# Altium project fast-open-switch r1.0.PrjPcb (part 1 of 8)
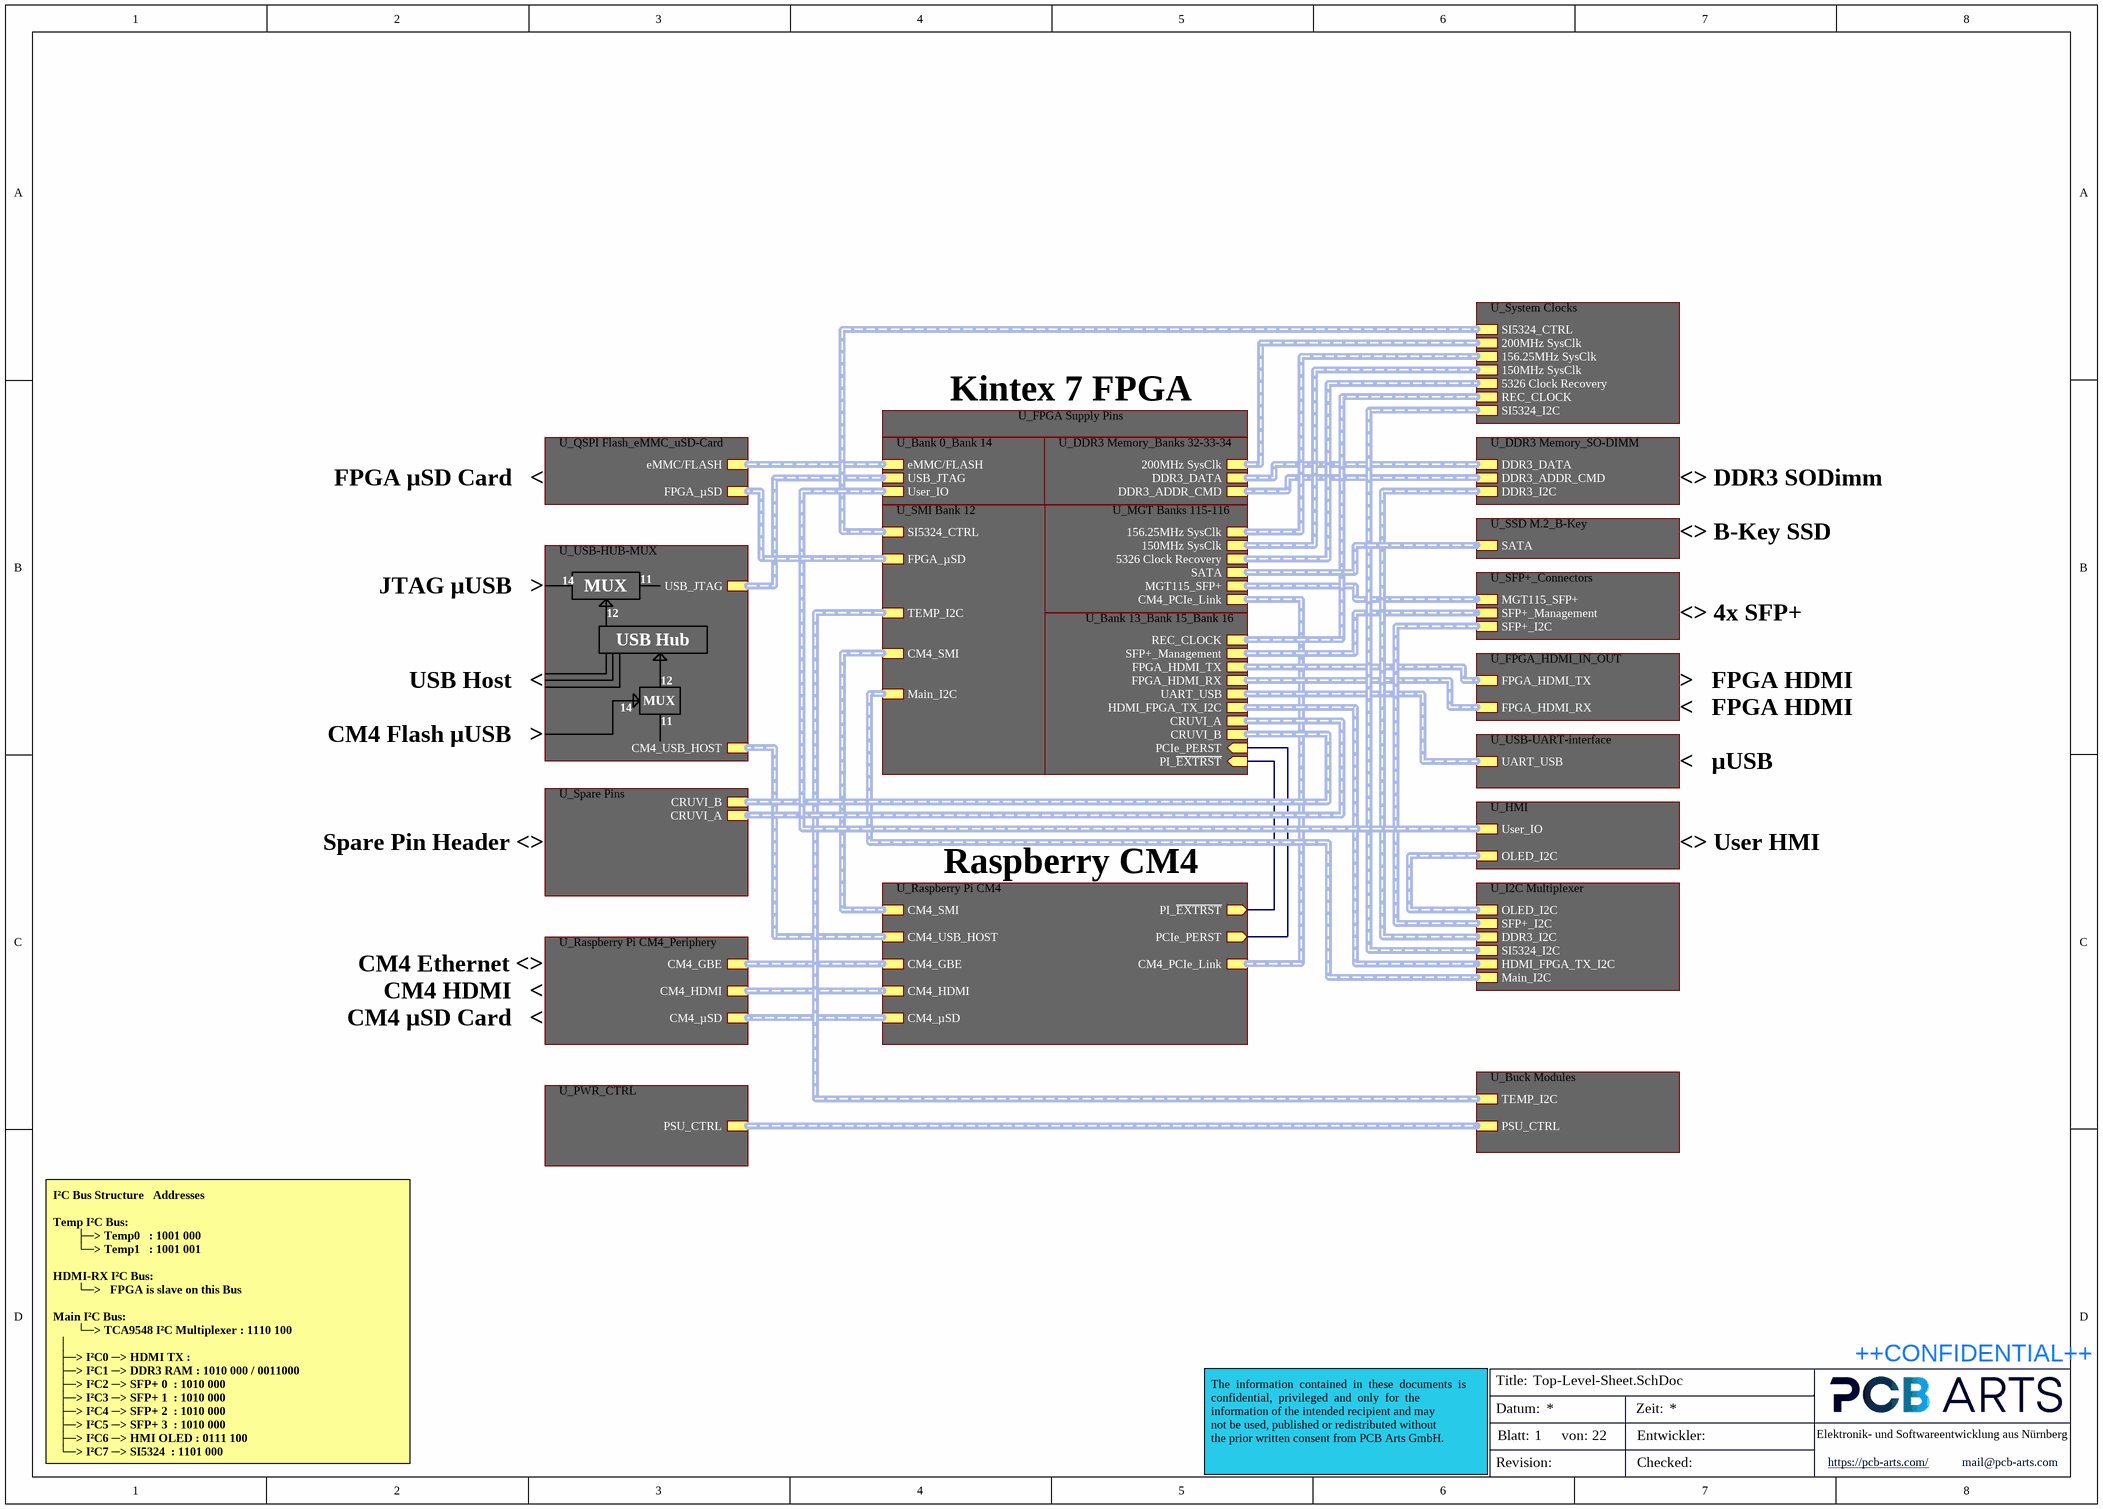
[diagram p0: Top-Level-Sheet.SchDoc]
22 sheets, 909 parts. Net scope: hierarchical (ports join the sheet entries above them; power ports are global).
Board file: fast-open-switch r1.0.PcbDoc
Sheets:
  Top-Level-Sheet.SchDoc
    U_Bank 0_Bank 14 = Bank 0_Bank 14.SchDoc
    U_Bank 13_Bank 15_Bank 16 = Bank 13_Bank 15_Bank 16.SchDoc
    U_DDR3 Memory_Banks 32-33-34 = DDR3 Memory_Banks 32-33-34.SchDoc
    U_DDR3 Memory_SO-DIMM = DDR3 Memory_SO-DIMM.SchDoc
    U_FPGA_HDMI_IN_OUT = FPGA_HDMI_IN_OUT.SchDoc
    U_HMI = HMI.SchDoc
    U_MGT Banks 115-116 = MGT Banks 115-116.SchDoc
    U_QSPI Flash_eMMC_uSD-Card = QSPI Flash_eMMC_uSD-Card.SchDoc
    U_Raspberry Pi CM4 = Raspberry Pi CM4.SchDoc
    U_SFP+_Connectors = SFP+_Connectors.SchDoc
    U_SMI Bank 12 = SMI Bank 12.SchDoc
    U_SSD M.2_B-Key = SSD M.2_B-Key.SchDoc
    U_USB-HUB-MUX = USB-HUB-MUX.SchDoc
    U_USB-UART-interface = USB-UART-interface.SchDoc
    U_Raspberry Pi CM4_Periphery = Raspberry Pi CM4_Periphery.SchDoc
    U_I2C Multiplexer = I2C Multiplexer.SchDoc
    U_System Clocks = System Clocks.SchDoc
    U_FPGA Supply Pins = FPGA Supply Pins.SchDoc
    U_PWR_CTRL = PWR_CTRL.SchDoc
    U_Buck Modules = Buck Modules.SchDoc
    U_Spare Pins = Spare Pins.SchDoc

## Sheet Top-Level-Sheet.SchDoc
size A3; SheetNumber: 1; SheetTotal: 22

### Sub-sheets
U_Bank 0_Bank 14 = Bank 0_Bank 14.SchDoc: eMMC/FLASH (harness eMMC/FLASH), USB_JTAG (harness USB_JTAG), User_IO (harness User_IO)
U_Bank 13_Bank 15_Bank 16 = Bank 13_Bank 15_Bank 16.SchDoc: UART_USB (harness UART_USB), FPGA_HDMI_TX (harness FPGA_HDMI_TX), FPGA_HDMI_RX (harness FPGA_HDMI_RX), HDMI_FPGA_TX_I2C (harness HDMI_FPGA_TX_I2C), SFP+_Management (harness SFP+_Management), REC_CLOCK (harness REC_CLOCK), PCIe_PERST (in), PI_~{EXTRST} (in), CRUVI_A (harness CRUVI_A), CRUVI_B (harness CRUVI_B)
U_Buck Modules = Buck Modules.SchDoc: PSU_CTRL (harness PSU_CTRL), TEMP_I2C (harness TEMP_I2C)
U_DDR3 Memory_Banks 32-33-34 = DDR3 Memory_Banks 32-33-34.SchDoc: DDR3_DATA (harness DDR3_DATA), DDR3_ADDR_CMD (harness DDR3_ADDR_CMD), 200MHz SysClk (harness 200MHz SysClk)
U_DDR3 Memory_SO-DIMM = DDR3 Memory_SO-DIMM.SchDoc: DDR3_DATA (harness DDR3_DATA), DDR3_ADDR_CMD (harness DDR3_ADDR_CMD), DDR3_I2C (harness DDR3_I2C)
U_FPGA Supply Pins = FPGA Supply Pins.SchDoc: no entries
U_FPGA_HDMI_IN_OUT = FPGA_HDMI_IN_OUT.SchDoc: FPGA_HDMI_TX (harness FPGA_HDMI_TX), FPGA_HDMI_RX (harness FPGA_HDMI_RX)
U_HMI = HMI.SchDoc: User_IO (harness User_IO), OLED_I2C (harness OLED_I2C)
U_I2C Multiplexer = I2C Multiplexer.SchDoc: HDMI_FPGA_TX_I2C (harness HDMI_FPGA_TX_I2C), DDR3_I2C (harness DDR3_I2C), SFP+_I2C (harness SFP+_I2C), OLED_I2C (harness OLED_I2C), Main_I2C (harness Main_I2C), SI5324_I2C (harness SI5324_I2C)
U_MGT Banks 115-116 = MGT Banks 115-116.SchDoc: MGT115_SFP+ (harness MGT115_SFP+), CM4_PCIe_Link (harness CM4_PCIe_Link), SATA (harness SATA), 150MHz SysClk (harness 150MHz SysClk), 5326 Clock Recovery (harness 5326 Clock Recovery), 156.25MHz SysClk (harness 156.25MHz SysClk)
U_PWR_CTRL = PWR_CTRL.SchDoc: PSU_CTRL (harness PSU_CTRL)
U_QSPI Flash_eMMC_uSD-Card = QSPI Flash_eMMC_uSD-Card.SchDoc: FPGA_µSD (harness FPGA_µSD), eMMC/FLASH (harness eMMC/FLASH)
U_Raspberry Pi CM4 = Raspberry Pi CM4.SchDoc: CM4_GBE (harness CM4_GBE), CM4_HDMI (harness CM4_HDMI), CM4_PCIe_Link (harness CM4_PCIe_Link), CM4_USB_HOST (harness CM4_USB_HOST), CM4_µSD (harness CM4_µSD), CM4_SMI (harness CM4_SMI), PCIe_PERST (out), PI_~{EXTRST} (out)
U_Raspberry Pi CM4_Periphery = Raspberry Pi CM4_Periphery.SchDoc: CM4_GBE (harness CM4_GBE), CM4_HDMI (harness CM4_HDMI), CM4_µSD (harness CM4_µSD)
U_SFP+_Connectors = SFP+_Connectors.SchDoc: MGT115_SFP+ (harness MGT115_SFP+), SFP+_Management (harness SFP+_Management), SFP+_I2C (harness SFP+_I2C)
U_SMI Bank 12 = SMI Bank 12.SchDoc: CM4_SMI (harness CM4_SMI), FPGA_µSD (harness FPGA_µSD), Main_I2C (harness Main_I2C), SI5324_CTRL (harness SI5324_CTRL), TEMP_I2C (harness TEMP_I2C)
U_Spare Pins = Spare Pins.SchDoc: CRUVI_A (harness CRUVI_A), CRUVI_B (harness CRUVI_B)
U_SSD M.2_B-Key = SSD M.2_B-Key.SchDoc: SATA (harness SATA)
U_System Clocks = System Clocks.SchDoc: 150MHz SysClk (harness 150MHz SysClk), 5326 Clock Recovery (harness 5326 Clock Recovery), 200MHz SysClk (harness 200MHz SysClk), REC_CLOCK (harness REC_CLOCK), SI5324_I2C (harness SI5324_I2C), SI5324_CTRL (harness SI5324_CTRL), 156.25MHz SysClk (harness 156.25MHz SysClk)
U_USB-HUB-MUX = USB-HUB-MUX.SchDoc: CM4_USB_HOST (harness CM4_USB_HOST), USB_JTAG (harness USB_JTAG)
U_USB-UART-interface = USB-UART-interface.SchDoc: UART_USB (harness UART_USB)

### Nets
PCIe_PERST: sheet U_Bank 13_Bank 15_Bank 16/PCIe_PERST, sheet U_Raspberry Pi CM4/PCIe_PERST
PI_~{EXTRST}: sheet U_Bank 13_Bank 15_Bank 16/PI_~{EXTRST}, sheet U_Raspberry Pi CM4/PI_~{EXTRST}

### Buses and harness runs
harness sheet U_Bank 0_Bank 14/eMMC/FLASH = sheet U_QSPI Flash_eMMC_uSD-Card/eMMC/FLASH
harness sheet U_Bank 0_Bank 14/USB_JTAG = sheet U_USB-HUB-MUX/USB_JTAG
harness sheet U_Bank 0_Bank 14/User_IO = sheet U_HMI/User_IO
harness sheet U_Bank 13_Bank 15_Bank 16/CRUVI_A = sheet U_Spare Pins/CRUVI_A
harness sheet U_Bank 13_Bank 15_Bank 16/CRUVI_B = sheet U_Spare Pins/CRUVI_B
harness sheet U_Bank 13_Bank 15_Bank 16/FPGA_HDMI_RX = sheet U_FPGA_HDMI_IN_OUT/FPGA_HDMI_RX
harness sheet U_Bank 13_Bank 15_Bank 16/FPGA_HDMI_TX = sheet U_FPGA_HDMI_IN_OUT/FPGA_HDMI_TX
harness sheet U_Bank 13_Bank 15_Bank 16/HDMI_FPGA_TX_I2C = sheet U_I2C Multiplexer/HDMI_FPGA_TX_I2C
harness sheet U_Bank 13_Bank 15_Bank 16/REC_CLOCK = sheet U_System Clocks/REC_CLOCK
harness sheet U_Bank 13_Bank 15_Bank 16/SFP+_Management = sheet U_SFP+_Connectors/SFP+_Management
harness sheet U_Bank 13_Bank 15_Bank 16/UART_USB = sheet U_USB-UART-interface/UART_USB
harness sheet U_Buck Modules/PSU_CTRL = sheet U_PWR_CTRL/PSU_CTRL
harness sheet U_Buck Modules/TEMP_I2C = sheet U_SMI Bank 12/TEMP_I2C
harness sheet U_DDR3 Memory_Banks 32-33-34/200MHz SysClk = sheet U_System Clocks/200MHz SysClk
harness sheet U_DDR3 Memory_Banks 32-33-34/DDR3_ADDR_CMD = sheet U_DDR3 Memory_SO-DIMM/DDR3_ADDR_CMD
harness sheet U_DDR3 Memory_Banks 32-33-34/DDR3_DATA = sheet U_DDR3 Memory_SO-DIMM/DDR3_DATA
harness sheet U_DDR3 Memory_SO-DIMM/DDR3_I2C = sheet U_I2C Multiplexer/DDR3_I2C
harness sheet U_HMI/OLED_I2C = sheet U_I2C Multiplexer/OLED_I2C
harness sheet U_I2C Multiplexer/Main_I2C = sheet U_SMI Bank 12/Main_I2C
harness sheet U_I2C Multiplexer/SFP+_I2C = sheet U_SFP+_Connectors/SFP+_I2C
harness sheet U_I2C Multiplexer/SI5324_I2C = sheet U_System Clocks/SI5324_I2C
harness sheet U_MGT Banks 115-116/150MHz SysClk = sheet U_System Clocks/150MHz SysClk
harness sheet U_MGT Banks 115-116/156.25MHz SysClk = sheet U_System Clocks/156.25MHz SysClk
harness sheet U_MGT Banks 115-116/5326 Clock Recovery = sheet U_System Clocks/5326 Clock Recovery
harness sheet U_MGT Banks 115-116/CM4_PCIe_Link = sheet U_Raspberry Pi CM4/CM4_PCIe_Link
harness sheet U_MGT Banks 115-116/MGT115_SFP+ = sheet U_SFP+_Connectors/MGT115_SFP+
harness sheet U_MGT Banks 115-116/SATA = sheet U_SSD M.2_B-Key/SATA
harness sheet U_QSPI Flash_eMMC_uSD-Card/FPGA_µSD = sheet U_SMI Bank 12/FPGA_µSD
harness sheet U_Raspberry Pi CM4/CM4_GBE = sheet U_Raspberry Pi CM4_Periphery/CM4_GBE
harness sheet U_Raspberry Pi CM4/CM4_HDMI = sheet U_Raspberry Pi CM4_Periphery/CM4_HDMI
harness sheet U_Raspberry Pi CM4/CM4_SMI = sheet U_SMI Bank 12/CM4_SMI
harness sheet U_Raspberry Pi CM4/CM4_USB_HOST = sheet U_USB-HUB-MUX/CM4_USB_HOST
harness sheet U_Raspberry Pi CM4/CM4_µSD = sheet U_Raspberry Pi CM4_Periphery/CM4_µSD
harness sheet U_SMI Bank 12/SI5324_CTRL = sheet U_System Clocks/SI5324_CTRL

### Notes on the sheet
- Kintex 7 FPGA
- FPGA µSD Card   <
- <> DDR3 SODimm
- JTAG µUSB   >
- 14
- MUX
- 11
- <> B-Key SSD
- 12
- USB Hub
- <> 4x SFP+
- USB Host   <
- >   FPGA HDMI
- <   FPGA HDMI
- CM4 Flash µUSB   >
- <   µUSB
- Spare Pin Header <>
- <> User HMI
- Raspberry CM4
- CM4 HDMI   <
- CM4 Ethernet <>
- CM4 µSD Card   <
- I²C Bus Structure			Addresses
  Temp I²C Bus:
  ├─>	Temp0			: 1001 000
  └─>	Temp1			: 1001 001
  HDMI-RX I²C Bus:
  └─>			FPGA is slave on this Bus
  Main I²C Bus:
  └─>	TCA9548 I²C Multiplexer	: 1110 100
  │
  ├─> I²C0 ─> HDMI TX	:
  ├─> I²C1 ─> DDR3 RAM	: 1010 000 / 0011000
  ├─> I²C2 ─> SFP+ 0		: 1010 000
  ├─> I²C3 ─> SFP+ 1		: 1010 000
  ├─> I²C4 ─> SFP+ 2		: 1010 000
  ├─> I²C5 ─> SFP+ 3		: 1010 000
  ├─> I²C6 ─> HMI OLED	: 0111 100
  └─> I²C7 ─> SI5324		: 1101 000
- Title:
- ++CONFIDENTIAL++
- Datum:
- Blatt:
- von:
- Zeit:
- Entwickler:
- Elektronik- und Softwareentwicklung aus Nürnberg
- The  information  contained  in  these  documents  is  confidential,  privileged  and  only  for  the
  information of the intended recipient and may
  not be used, published or redistributed without
  the prior written consent from PCB Arts GmbH.
- Revision:
- Checked:
- https://pcb-arts.com/
- mail@pcb-arts.com

## Sheet Bank 0_Bank 14.SchDoc
size A3; SheetNumber: 12; SheetTotal: 22
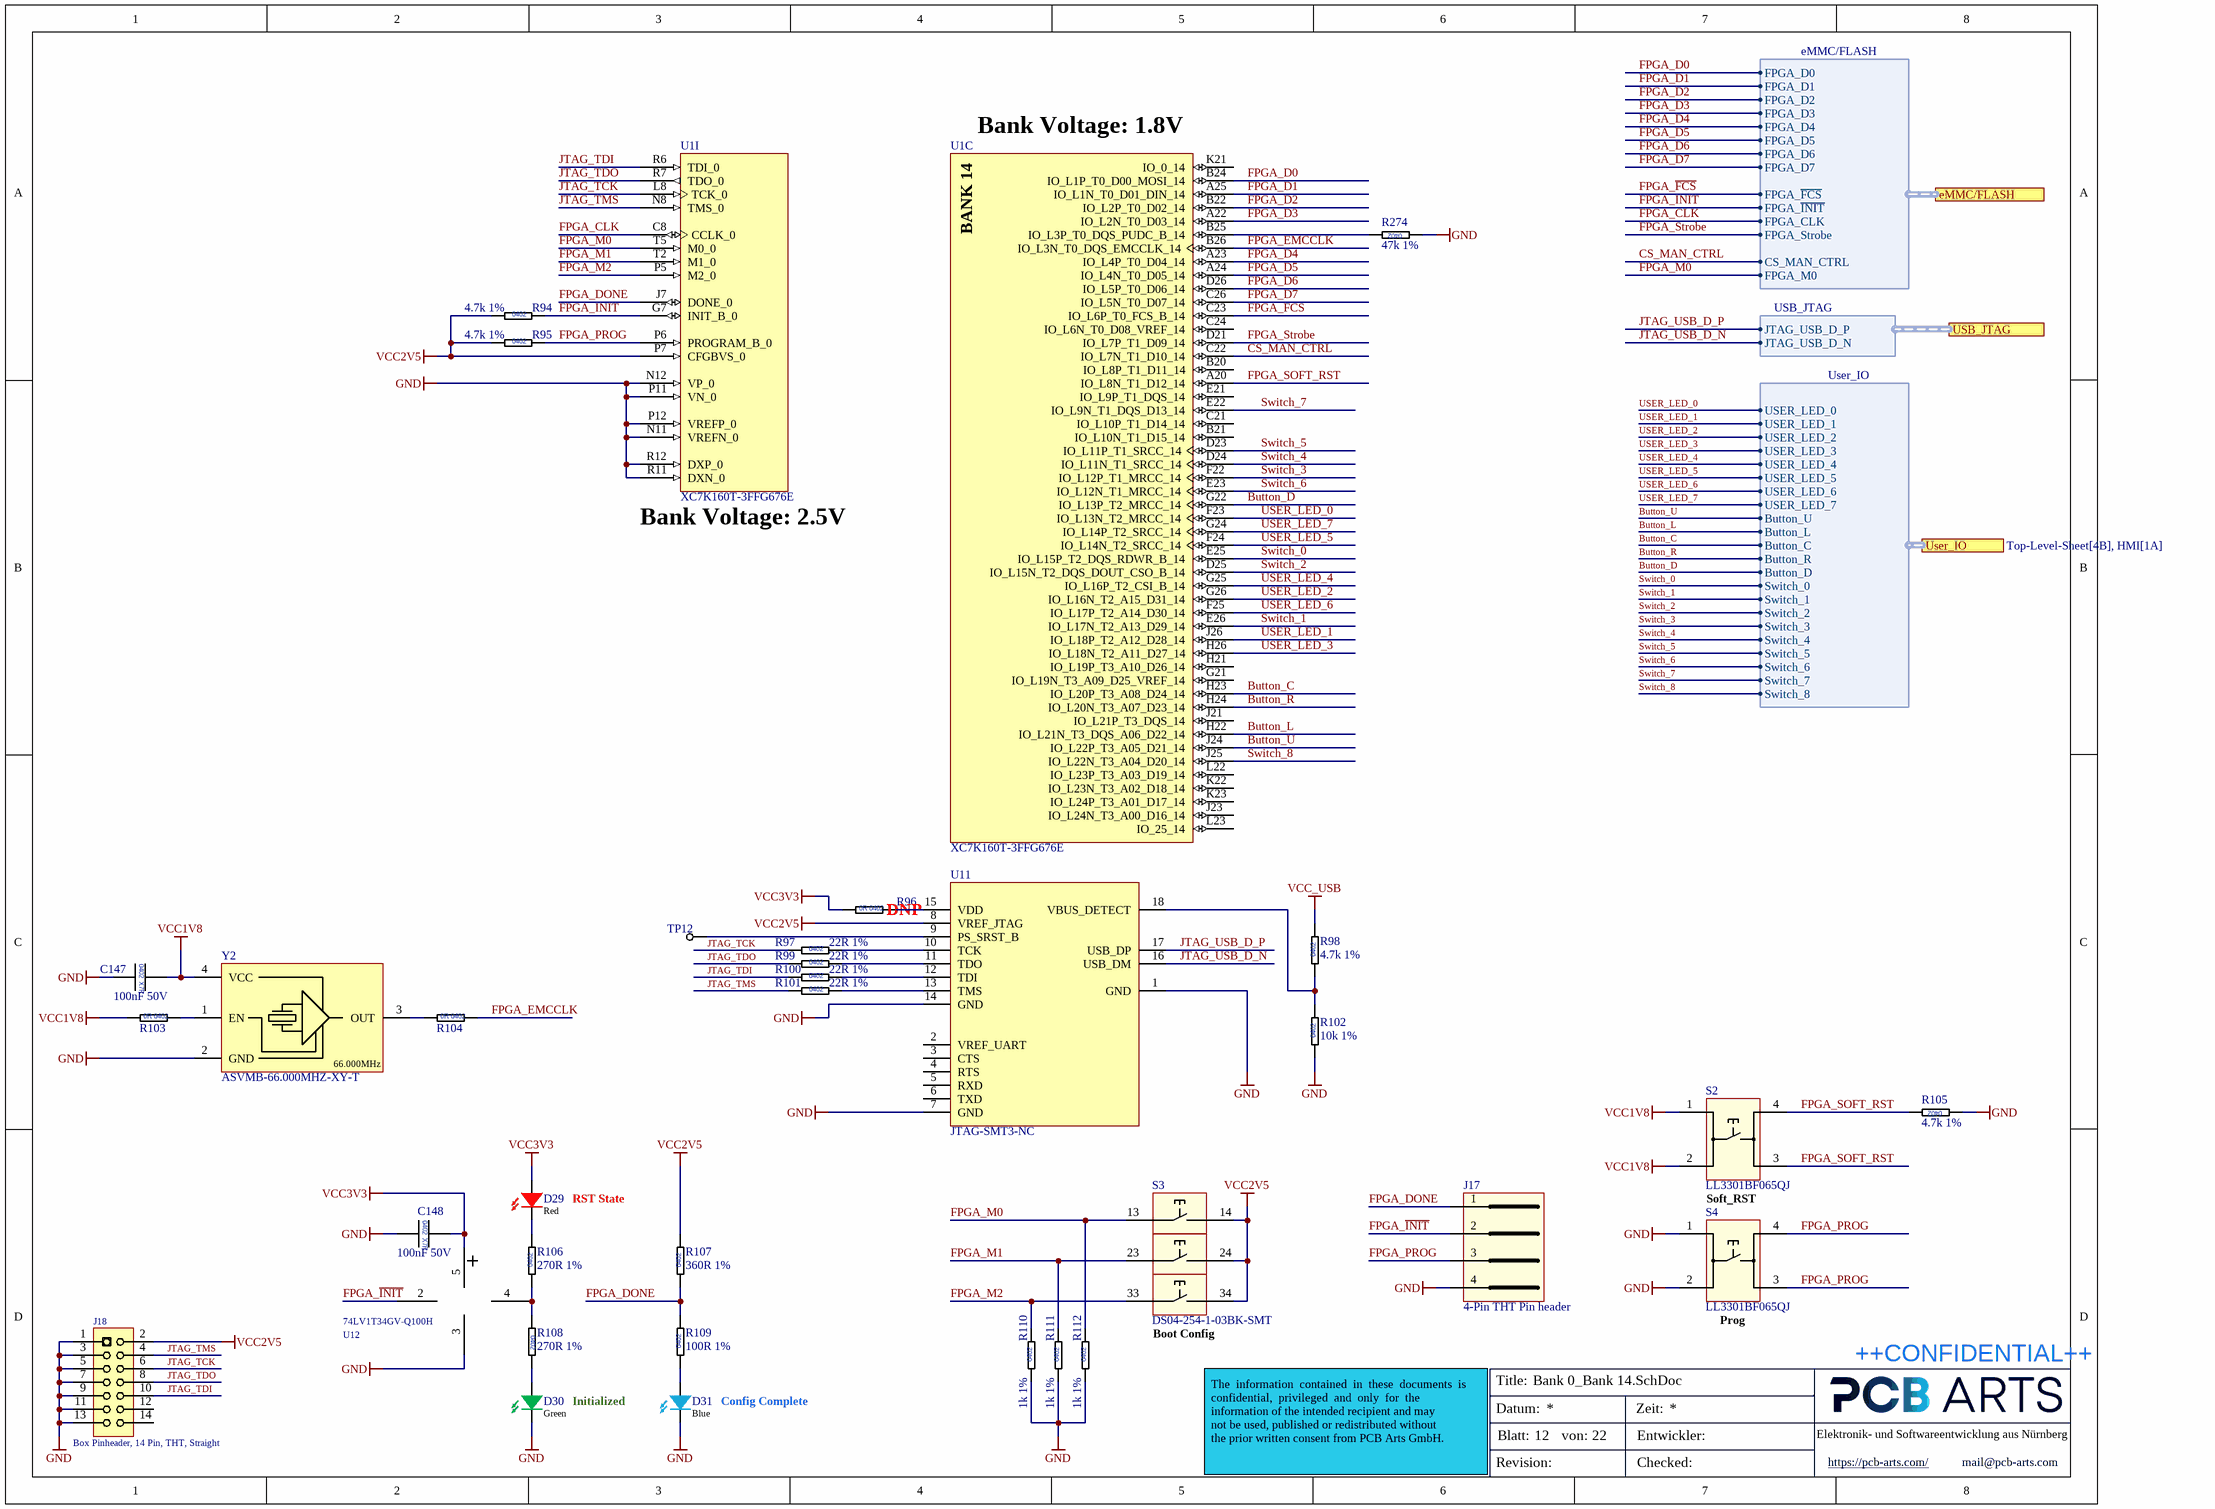
[diagram p1: Bank 0_Bank 14.SchDoc]

### Parts
C147  100nF 50V  [CAP_0402_L]
C148  100nF 50V  [CAP_0402_L]
D29  Color: Red  [LED-0603 Sideview]  (hidden comment: LTST-S270KRKT)
D30  Color: Green  [LED-0603 Sideview]  (hidden comment: LTST-S270KGKT)
D31  Color: Blue  [LED-0603 Sideview]  (hidden comment: LTST-S270TBKT)
J17  4-Pin THT Pin header  [61300411121]
J18  Box Pinheader, 14 Pin, THT, Straight  [87832-1420]
R94  4.7k 1%  [RES_0402_L]
R95  4.7k 1%  [RES_0402_L]
R96  0R Jumper  [RES_0402_L]  (value not drawn)  (no BOM)
R97  22R 1%  [RES_0402_L]
R98  4.7k 1%  [RES_0402_L]
R99  22R 1%  [RES_0402_L]
R100  22R 1%  [RES_0402_L]
R101  22R 1%  [RES_0402_L]
R102  10k 1%  [RES_0402_L]
R103  0R Jumper  [RES_0402_L]  (value not drawn)
R104  0R Jumper  [RES_0402_L]  (value not drawn)
R105  4.7k 1%  [RES_0402_L]
R106  270R 1%  [RES_0402_L]
R107  360R 1%  [RES_0402_L]
R108  270R 1%  [RES_0402_L]
R109  100R 1%  [RES_0402_L]
R110  1k 1%  [RES_0402_L]
R111  1k 1%  [RES_0402_L]
R112  1k 1%  [RES_0402_L]
R274  47k 1%  [RES_0402_L]
S2  LL3301BF065QJ  [LL3301BF065QJ]
S3  DS04-254-1-03BK-SMT  [CUI DS04-254-SMT Series, 3 Pole]
S4  LL3301BF065QJ  [LL3301BF065QJ]
TP12  Testpoint  [Testpoint 0.8mm]  (value not drawn)  (no BOM)
U1  XC7K160T-3FFG676E  [BGA100P2700X2700X317-676N]  (parts C,I of 14)
U11  JTAG-SMT3-NC  [JTAG-SMT3-NC]
U12  74LV1T34GV-Q100H  [SOT95P275X110-5N]
Y2  ASVMB-66.000MHZ-XY-T  [ASVMB Series]

### Ports
eMMC/FLASH (harness eMMC/FLASH, see Top-Level-Sheet[4B], QSPI Flash_eMMC_uSD-Card[1A]), USB_JTAG (harness USB_JTAG, see Top-Level-Sheet[4B], USB-HUB-MUX[8C]), User_IO (harness User_IO, see Top-Level-Sheet[4B], HMI[1A])

### Harnesses
eMMC/FLASH: FPGA_D0, FPGA_D1, FPGA_D2, FPGA_D3, FPGA_D4, FPGA_D5, FPGA_D6, FPGA_D7, FPGA_~{FCS}, FPGA_~{INIT}, FPGA_CLK, FPGA_Strobe, FPGA_M0, CS_MAN_CTRL
USB_JTAG: JTAG_USB_D_P, JTAG_USB_D_N
User_IO: USER_LED_0, USER_LED_1, USER_LED_2, USER_LED_3, USER_LED_4, USER_LED_5, USER_LED_6, USER_LED_7, Switch_0, Switch_1, Switch_2, Switch_3, Switch_4, Switch_5, Button_L, Button_U, Button_C, Button_R, Button_D, Switch_6, Switch_7, Switch_8

### Nets
GND: C147.2 C148.2 D30.1 D31.1 J17.4 J18.1 J18.3 J18.5 J18.7 J18.9 J18.11 J18.13 R102.1 R105.1 R110.1 R111.1 R112.1 R274.1 S4.1 S4.2 U1.N11(VREFN_0) U1.N12(VP_0) U1.P11(VN_0) U1.P12(VREFP_0) U1.R11(DXN_0) U1.R12(DXP_0) U11.1(GND) U11.7(GND) U11.14(GND) U12.3(GND) Y2.2(GND)
VCC1V8: C147.1 R103.1 S2.1 S2.2 Y2.4(VCC)
VCC2V5: J18.2 R94.1 R95.1 R107.2 S3.14 S3.24 S3.34 U1.P7(CFGBVS_0) U11.8(VREF_JTAG)
VCC3V3: C148.1 D29.2 R96.1 U12.5(VCC)
VCC_USB: R98.2
Button_C: U1.H23(IO_L20P_T3_A08_D24_14) ; port User_IO.Button_C
Button_D: U1.G22(IO_L13P_T2_MRCC_14) ; port User_IO.Button_D
Button_L: U1.H22(IO_L21N_T3_DQS_A06_D22_14) ; port User_IO.Button_L
Button_R: U1.H24(IO_L20N_T3_A07_D23_14) ; port User_IO.Button_R
Button_U: U1.J24(IO_L22P_T3_A05_D21_14) ; port User_IO.Button_U
CS_MAN_CTRL: U1.C22(IO_L7N_T1_D10_14) ; port eMMC/FLASH.CS_MAN_CTRL
FPGA_CLK: U1.C8(CCLK_0) ; port eMMC/FLASH.FPGA_CLK
FPGA_D0: U1.B24(IO_L1P_T0_D00_MOSI_14) ; port eMMC/FLASH.FPGA_D0
FPGA_D1: U1.A25(IO_L1N_T0_D01_DIN_14) ; port eMMC/FLASH.FPGA_D1
FPGA_D2: U1.B22(IO_L2P_T0_D02_14) ; port eMMC/FLASH.FPGA_D2
FPGA_D3: U1.A22(IO_L2N_T0_D03_14) ; port eMMC/FLASH.FPGA_D3
FPGA_D4: U1.A23(IO_L4P_T0_D04_14) ; port eMMC/FLASH.FPGA_D4
FPGA_D5: U1.A24(IO_L4N_T0_D05_14) ; port eMMC/FLASH.FPGA_D5
FPGA_D6: U1.D26(IO_L5P_T0_D06_14) ; port eMMC/FLASH.FPGA_D6
FPGA_D7: U1.C26(IO_L5N_T0_D07_14) ; port eMMC/FLASH.FPGA_D7
FPGA_DONE: J17.1 R107.1 R109.2 U1.J7(DONE_0)
FPGA_EMCCLK: R104.2 U1.B26(IO_L3N_T0_DQS_EMCCLK_14)
FPGA_~{FCS}: U1.C23(IO_L6P_T0_FCS_B_14) ; port eMMC/FLASH.FPGA_~{FCS}
FPGA_~{INIT}: J17.2 R94.2 U1.G7(INIT_B_0) U12.2(A) ; port eMMC/FLASH.FPGA_~{INIT}
FPGA_M0: R112.2 S3.13 U1.T5(M0_0) ; port eMMC/FLASH.FPGA_M0
FPGA_M1: R111.2 S3.23 U1.T2(M1_0)
FPGA_M2: R110.2 S3.33 U1.P5(M2_0)
FPGA_PROG: J17.3 R95.2 S4.3 S4.4 U1.P6(PROGRAM_B_0)
FPGA_SOFT_RST: R105.2 S2.3 S2.4 U1.A20(IO_L8N_T1_D12_14)
FPGA_Strobe: U1.D21(IO_L7P_T1_D09_14) ; port eMMC/FLASH.FPGA_Strobe
JTAG_TCK: J18.6 R97.1 U1.L8(TCK_0)
JTAG_TDI: J18.10 R100.1 U1.R6(TDI_0)
JTAG_TDO: J18.8 R99.1 U1.R7(TDO_0)
JTAG_TMS: J18.4 R101.1 U1.N8(TMS_0)
JTAG_USB_D_N: U11.16(USB_DM) ; port USB_JTAG.JTAG_USB_D_N
JTAG_USB_D_P: U11.17(USB_DP) ; port USB_JTAG.JTAG_USB_D_P
Switch_0: U1.E25(IO_L15P_T2_DQS_RDWR_B_14) ; port User_IO.Switch_0
Switch_1: U1.E26(IO_L17N_T2_A13_D29_14) ; port User_IO.Switch_1
Switch_2: U1.D25(IO_L15N_T2_DQS_DOUT_CSO_B_14) ; port User_IO.Switch_2
Switch_3: U1.F22(IO_L12P_T1_MRCC_14) ; port User_IO.Switch_3
Switch_4: U1.D24(IO_L11N_T1_SRCC_14) ; port User_IO.Switch_4
Switch_5: U1.D23(IO_L11P_T1_SRCC_14) ; port User_IO.Switch_5
Switch_6: U1.E23(IO_L12N_T1_MRCC_14) ; port User_IO.Switch_6
Switch_7: U1.E22(IO_L9N_T1_DQS_D13_14) ; port User_IO.Switch_7
Switch_8: U1.J25(IO_L22N_T3_A04_D20_14) ; port User_IO.Switch_8
USER_LED_0: U1.F23(IO_L13N_T2_MRCC_14) ; port User_IO.USER_LED_0
USER_LED_1: U1.J26(IO_L18P_T2_A12_D28_14) ; port User_IO.USER_LED_1
USER_LED_2: U1.G26(IO_L16N_T2_A15_D31_14) ; port User_IO.USER_LED_2
USER_LED_3: U1.H26(IO_L18N_T2_A11_D27_14) ; port User_IO.USER_LED_3
USER_LED_4: U1.G25(IO_L16P_T2_CSI_B_14) ; port User_IO.USER_LED_4
USER_LED_5: U1.F24(IO_L14N_T2_SRCC_14) ; port User_IO.USER_LED_5
USER_LED_6: U1.F25(IO_L17P_T2_A14_D30_14) ; port User_IO.USER_LED_6
USER_LED_7: U1.G24(IO_L14P_T2_SRCC_14) ; port User_IO.USER_LED_7
NetD29_1: D29.1 R106.2
NetD30_2: D30.2 R108.2
NetD31_2: D31.2 R109.1
NetR96_2: R96.2 U11.15(VDD)
NetR97_2: R97.2 U11.10(TCK)
NetR98_1: R98.1 R102.2 U11.18(VBUS_DETECT)
NetR99_2: R99.2 U11.11(TDO)
NetR100_2: R100.2 U11.12(TDI)
NetR101_2: R101.2 U11.13(TMS)
NetR103_2: R103.2 Y2.1(EN)
NetR104_1: R104.1 Y2.3(OUT)
NetR106_1: R106.1 R108.1 U12.4(Y)
NetR274_2: R274.2 U1.B25(IO_L3P_T0_DQS_PUDC_B_14)
NetTP12_1: TP12.1(GND) U11.9(PS_SRST_B)

Not connected (* = marked no-connect by the designer): J18 12 14; U1 B20(IO_L8P_T1_D11_14) B21(IO_L10N_T1_D15_14) C21(IO_L10P_T1_D14_14) C24(IO_L6N_T0_D08_VREF_14) E21(IO_L9P_T1_DQS_14) G21(IO_L19N_T3_A09_D25_VREF_14) H21(IO_L19P_T3_A10_D26_14) J21(IO_L21P_T3_DQS_14) J23(IO_L24N_T3_A00_D16_14) K21(IO_0_14) K22(IO_L23N_T3_A02_D18_14) K23(IO_L24P_T3_A01_D17_14) L22(IO_L23P_T3_A03_D19_14) L23(IO_25_14); U11 2(VREF_UART) 3(CTS) 4(RTS) 5(RXD) 6(TXD)

### Notes on the sheet
- (near U1) Bank Voltage: 1.8V
- (near U1) Bank Voltage: 2.5V
- (near R96) DNP
- RST State
- Soft_RST
- (near S4) Prog
- (near S3) Boot Config
- Initialized
- Config Complete
- Title:
- ++CONFIDENTIAL++
- Datum:
- Blatt:
- von:
- Zeit:
- Entwickler:
- Elektronik- und Softwareentwicklung aus Nürnberg
- The  information  contained  in  these  documents  is  confidential,  privileged  and  only  for  the
  information of the intended recipient and may
  not be used, published or redistributed without
  the prior written consent from PCB Arts GmbH.
- Revision:
- Checked:
- https://pcb-arts.com/
- mail@pcb-arts.com
- (in symbol ASVMB-66.000MHZ-XY-T_Clock-Memsoszillator 66.000MHz 1.8V 10ppm -40C +105C) 66.000MHz
- (in symbol CAP_0402_100nF_50V) 0402; X7R
- (in symbol RES_0402_0R Jumper) 0R 0402
- (in symbol RES_0402_1k_1%) 0402
- (in symbol RES_0402_4.7k_1%) 0402
- (in symbol RES_0402_10k_1%) 0402
- (in symbol RES_0402_22R_1%) 0402
- (in symbol RES_0402_47k_1%) 0402
- (in symbol RES_0402_100R_1%) 0402
- (in symbol RES_0402_270R 1%) 0402
- (in symbol RES_0402_360R_1%) 0402
- (in symbol XC7K160T-3FFG676E_Kintex-7 FPGA, 400 User I/Os, 8 GTX, FFG676, part C) BANK 14

### Library data of the parts
C147 C148 = CAP_0402_100nF_50V: Multilayer Ceramic Capacitors MLCC - SMD/SMT 0402 50VDC; Manufacturer 1: Murata Electronics; Manufacturer 1 Prt. Nr.: GCM155L8EH104KE07D; Manufacturer 2 Prt. Nr.: UMK105B7104KV-FR; Manufacturer 2: TDK
D29 = LED 0603 Red Sideview: RED  0603 Light Emitting Diode; Manufacturer 1: lite-On; Manufacturer 1 Prt. Nr.: LTST-S270KRKT
D30 = LED 0603 Green Sideview: GREEN  0603 Light Emitting Diode; Manufacturer 1: lite-On; Manufacturer 1 Prt. Nr.: LTST-S270KGKT
D31 = LED 0603 Blue Sideview: BLUE  0603 Light Emitting Diode; Manufacturer 1: lite-On; Manufacturer 1 Prt. Nr.: LTST-S270TBKT
J17 = 61300411121_WR-PHD 2.54mm 4Pin THT Header: WR-PHD 2.54mm 4Pin THT Header; Manufacturer 1: Würth Elektronik; Manufacturer 1 Prt. Nr.: 61300411121
J18 = 87832-1420_Box Pin header THT 2.00mm Box 14Pol Straight: Box Pin header THT 2.00mm 14Pol Straight; Manufacturer 1: Molex; Manufacturer 1 Prt. Nr.: 87832-1420
R94 R95 R98 R105 = RES_0402_4.7k_1%: Thick Film Resistors - SMD 4.7kOhm 1%; Manufacturer 1: Vishay / Dale; Manufacturer 1 Prt. Nr.: CRCW04024K70FKEDC; Manufacturer 2 Prt. Nr.: RC0402FR-134K7L; Manufacturer 2: Yageo
R96 R103 R104 = RES_0402_0R Jumper: Thick Film Resistors - SMD 0Ohm; Manufacturer 1: Vishay / Dale; Manufacturer 1 Prt. Nr.: CRCW04020000Z0EDC; Manufacturer 2 Prt. Nr.: RC0402JR-070RL; Manufacturer 2: Yageo
R97 R99-R101 = RES_0402_22R_1%: Thick Film Resistors - SMD 22Ohm 1%; Manufacturer 1: Vishay / Dale; Manufacturer 1 Prt. Nr.: CRCW040222R0FKEDC; Manufacturer 2 Prt. Nr.: RC0402FR-7W22RL; Manufacturer 2: Yageo
R102 = RES_0402_10k_1%: Thick Film Resistors - SMD 10kOhm 1%; Manufacturer 1: Vishay / Dale; Manufacturer 1 Prt. Nr.: CRCW040210K0FKEDC; Manufacturer 2 Prt. Nr.: RC0402FR-7W10KL; Manufacturer 2: Yageo
R106 R108 = RES_0402_270R 1%: Thick Film Resistors - SMD 270Ohm 1%; Manufacturer 1: Vishay / Dale; Manufacturer 1 Prt. Nr.: CRCW0402270RFKEDC; Manufacturer 2 Prt. Nr.: RC0402FR-07270RL; Manufacturer 2: Yageo
R107 = RES_0402_360R_1%: Thick Film Resistors - SMD 360Ohm 1%; Manufacturer 1: Vishay / Dale; Manufacturer 1 Prt. Nr.: CRCW0402360RFKED; Manufacturer 2 Prt. Nr.: AC0402FR-07360RL; Manufacturer 2: Yageo
R109 = RES_0402_100R_1%: Thick Film Resistors - SMD 100Ohm 1%; Manufacturer 1: Vishay / Dale; Manufacturer 1 Prt. Nr.: CRCW0402100RFKEE; Manufacturer 2 Prt. Nr.: RC0402FR-7W100RL; Manufacturer 2: Yageo
R110-R112 = RES_0402_1k_1%: Thick Film Resistors - SMD 1kOhm 1%; Manufacturer 1: Vishay / Dale; Manufacturer 1 Prt. Nr.: CRCW04021K00FKEDC; Manufacturer 2 Prt. Nr.: RC0402FR-7W1KL; Manufacturer 2: Yageo
R274 = RES_0402_47k_1%: Thick Film Resistors - SMD 47kOhm 1%; Manufacturer 1: Vishay / Dale; Manufacturer 1 Prt. Nr.: CRCW040247K0FKEDC; Manufacturer 2 Prt. Nr.: RC0402FR-7W47KL; Manufacturer 2: Yageo
S2 S4 = LL3301BF065QJ_SPST Top Actuated  Button, 65gf, SMD h: 9.8mm: SPST Top Actuated  Button, 65gf, SMD h: 9.8mm; Manufacturer 1: E-Switch; Manufacturer 1 Prt. Nr.: LL3301BF065QJ
S3 = DS04-254-1-03BK-SMT: SMD DIP Switch, 3 Pos, Slide actuator; Manufacturer 1: CUI Devices; Manufacturer 1 Prt. Nr.: DS04-254-1-03BK-SMT
TP12 = Testpoint 0.8mm
U1 = XC7K160T-3FFG676E_Kintex-7 FPGA, 400 User I/Os, 8 GTX, FFG676: Kintex-7 FPGA, 400 User I/Os, 8 GTX, 676-Ball BGA, Speed Grade 3, Extended Grade, Pb-Free; Manufacturer 1: Xilinx; Manufacturer 1 Prt. Nr.: XC7K160T-3FFG676E; ComponentLink1URL: http://www.xilinx.com/support/documentation/data_sheets/ds180_7Series_Overview.pdf; ComponentLink2URL: http://www.xilinx.com/support/documentation/user_guides/ug865-Zynq-7000-Pkg-Pinout.pdf; ComponentLink1Description: Datasheet; ComponentLink2Description: Package Specification
U11 = JTAG-SMT3-NC_Surface-mount JTAG Programming + UART Module: Surface-mount JTAG Programming + UART Module; Manufacturer 1: Digilent; Manufacturer 1 Prt. Nr.: JTAG-SMT3-NC
U12 = 74LV1T34GV-Q100H_Single supply translating buffe: Single supply translating buffer; Manufacturer 1: Nexperia; Manufacturer 1 Prt. Nr.: 74LV1T34GV-Q100H
Y2 = ASVMB-66.000MHZ-XY-T_Clock-Memsoszillator 66.000MHz 1.8V 10ppm -40C +105C: Clock-Memsoszillator 66.000MHz 1.8V 10ppm -40C +105C; Manufacturer 1: ABRACON; Manufacturer 1 Prt. Nr.: ASVMB-66.000MHZ-XY-T

## Sheet Bank 13_Bank 15_Bank 16.SchDoc
size A3; SheetNumber: 11; SheetTotal: 22
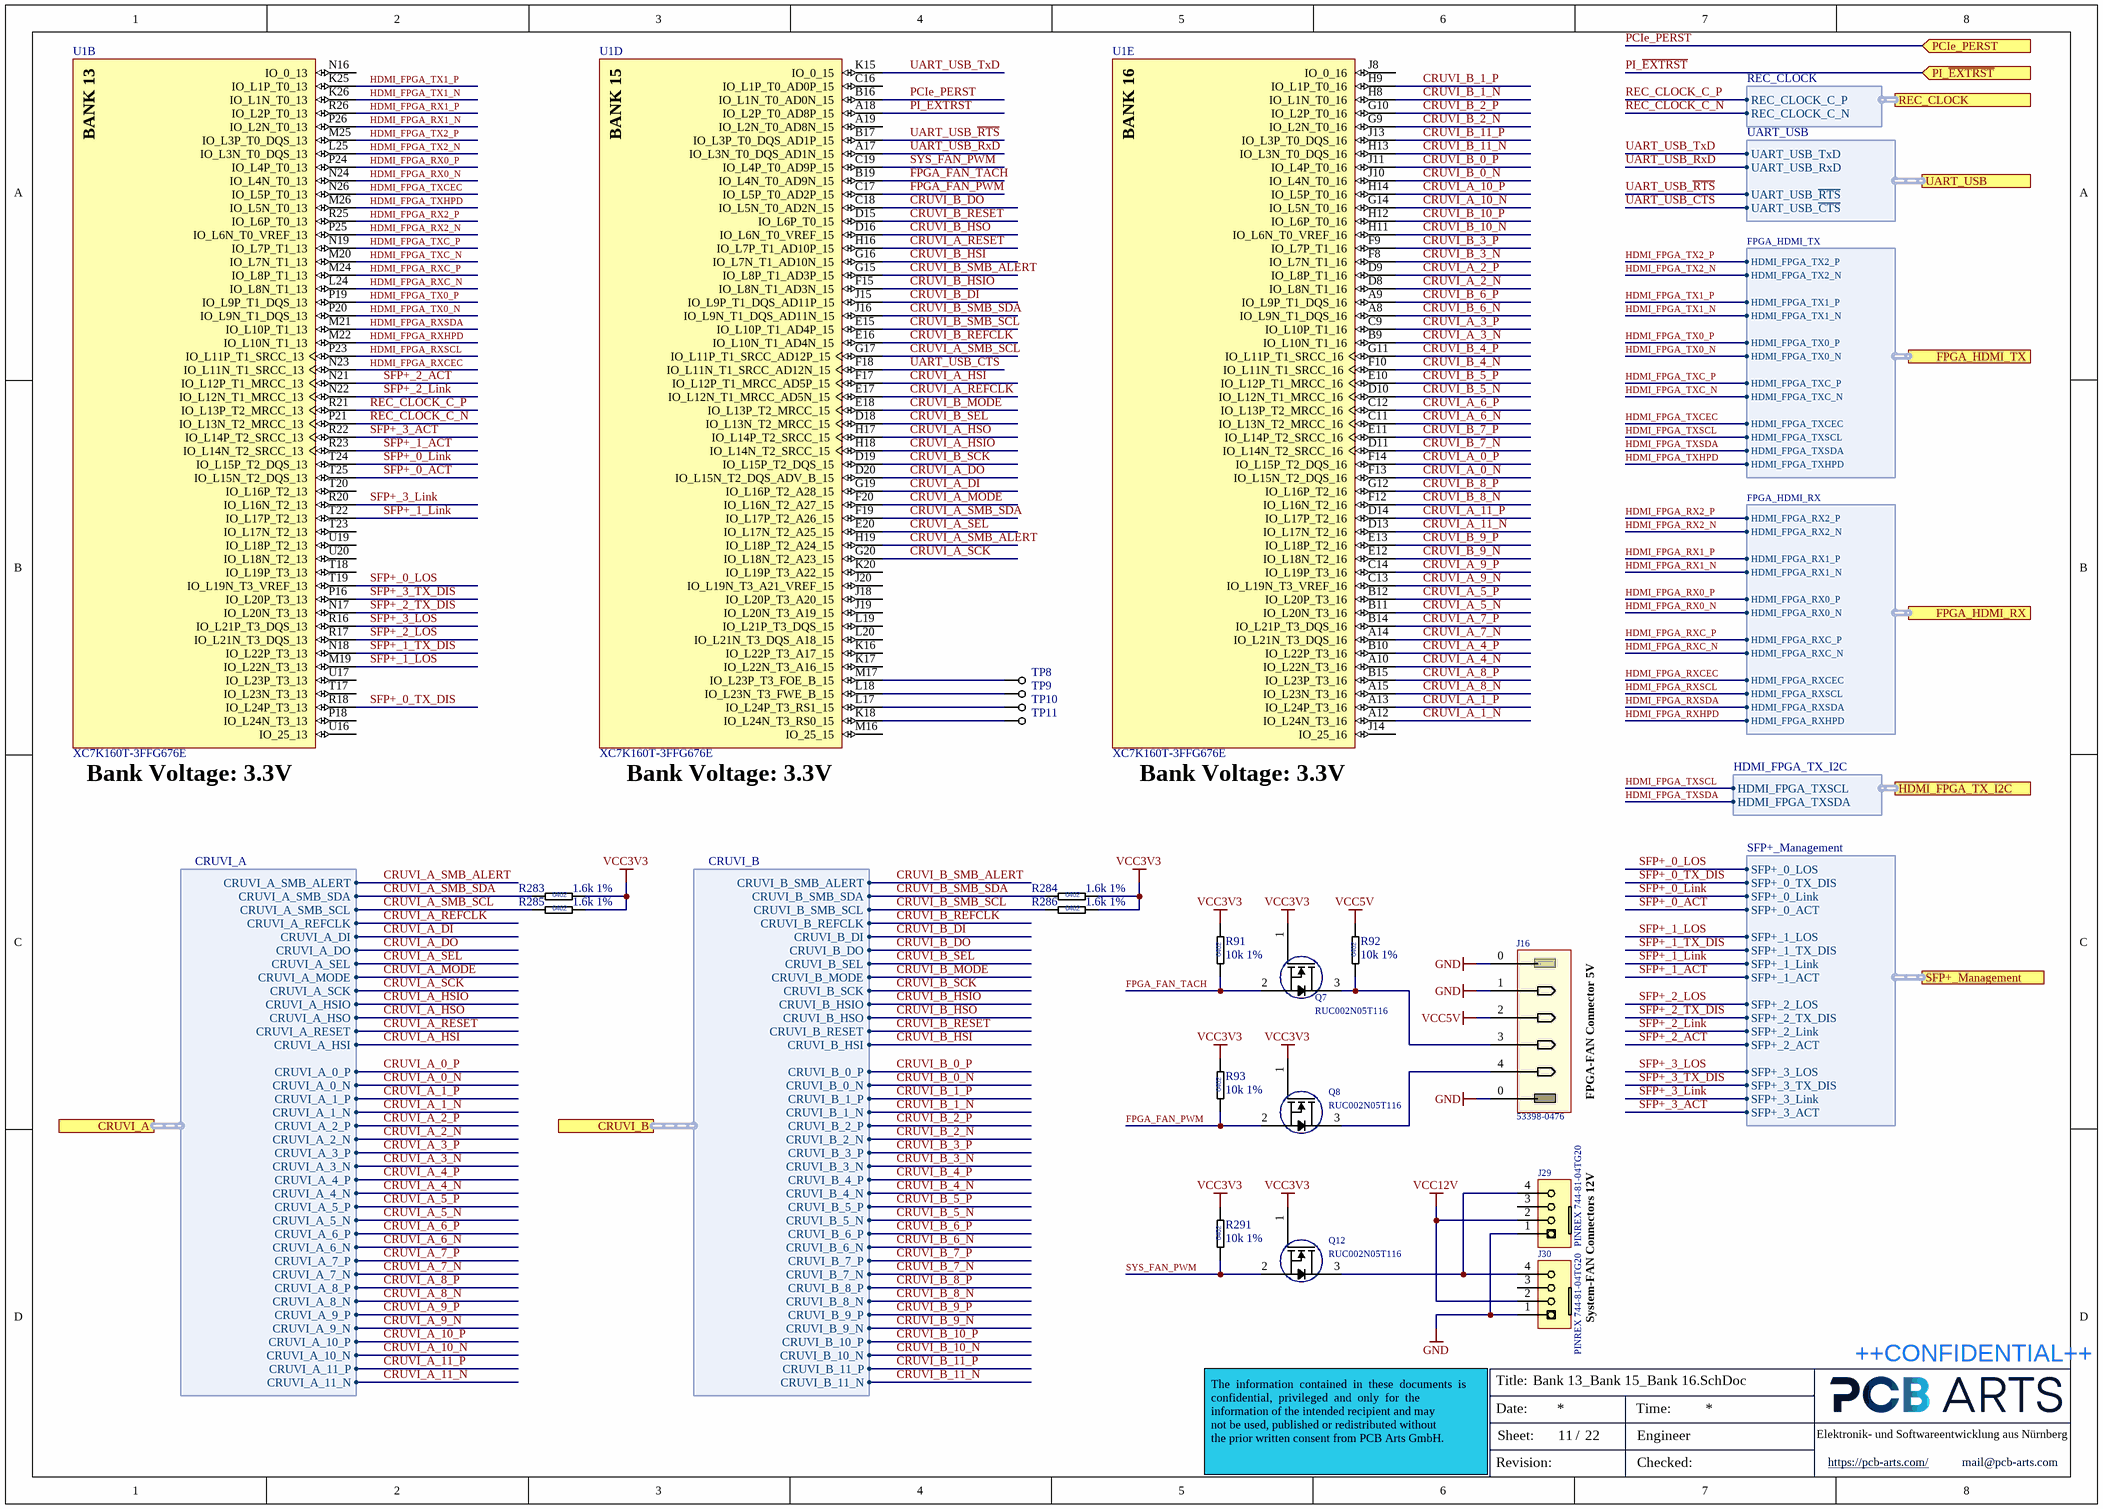
[diagram p2: Bank 13_Bank 15_Bank 16.SchDoc]

### Parts
J16  53398-0476  [Molex 53398-0476]
J29  PINREX 744-81-04TG20  [PINREX 744-81-04TG20]
J30  PINREX 744-81-04TG20  [PINREX 744-81-04TG20]
Q7  RUC002N05T116  [SOT95P251X112-3N]
Q8  RUC002N05T116  [SOT95P251X112-3N]
Q12  RUC002N05T116  [SOT95P251X112-3N]
R91  10k 1%  [RES_0402_L]
R92  10k 1%  [RES_0402_L]
R93  10k 1%  [RES_0402_L]
R283  1.6k 1%  [RES_0402_L]
R284  1.6k 1%  [RES_0402_L]
R285  1.6k 1%  [RES_0402_L]
R286  1.6k 1%  [RES_0402_L]
R291  10k 1%  [RES_0402_L]
TP8  Testpoint  [Testpoint 0.8mm]  (value not drawn)  (no BOM)
TP9  Testpoint  [Testpoint 0.8mm]  (value not drawn)  (no BOM)
TP10  Testpoint  [Testpoint 0.8mm]  (value not drawn)  (no BOM)
TP11  Testpoint  [Testpoint 0.8mm]  (value not drawn)  (no BOM)
U1  XC7K160T-3FFG676E  [BGA100P2700X2700X317-676N]  (parts B,D,E of 14)

### Ports
CRUVI_A (harness CRUVI_A, see Top-Level-Sheet[5B], Spare Pins[1B]), CRUVI_B (harness CRUVI_B, see Top-Level-Sheet[5B], Spare Pins[1C]), FPGA_HDMI_RX (harness FPGA_HDMI_RX, see Top-Level-Sheet[5B], FPGA_HDMI_IN_OUT[1D]), FPGA_HDMI_TX (harness FPGA_HDMI_TX, see Top-Level-Sheet[5B], FPGA_HDMI_IN_OUT[1A]), HDMI_FPGA_TX_I2C (harness HDMI_FPGA_TX_I2C, see Top-Level-Sheet[5B], I2C Multiplexer[7A]), PCIe_PERST (in, see Top-Level-Sheet[5B], Raspberry Pi CM4[8B]), PI_~{EXTRST} (in, see Top-Level-Sheet[5C], Raspberry Pi CM4[8B]), REC_CLOCK (harness REC_CLOCK, see Top-Level-Sheet[5B], System Clocks[1A]), SFP+_Management (harness SFP+_Management, see Top-Level-Sheet[5B], SFP+_Connectors[8C]), UART_USB (harness UART_USB, see Top-Level-Sheet[5B], USB-UART-interface[8A])

### Harnesses
UART_USB: UART_USB_TxD, UART_USB_RxD, UART_USB_~{RTS}, UART_USB_~{CTS}
FPGA_HDMI_TX: HDMI_FPGA_TX2_P, HDMI_FPGA_TX2_N, HDMI_FPGA_TX1_P, HDMI_FPGA_TX1_N, HDMI_FPGA_TX0_P, HDMI_FPGA_TX0_N, HDMI_FPGA_TXC_P, HDMI_FPGA_TXC_N, HDMI_FPGA_TXCEC, HDMI_FPGA_TXSCL, HDMI_FPGA_TXSDA, HDMI_FPGA_TXHPD
FPGA_HDMI_RX: HDMI_FPGA_RX2_P, HDMI_FPGA_RX2_N, HDMI_FPGA_RX1_P, HDMI_FPGA_RX1_N, HDMI_FPGA_RX0_P, HDMI_FPGA_RX0_N, HDMI_FPGA_RXC_P, HDMI_FPGA_RXC_N, HDMI_FPGA_RXCEC, HDMI_FPGA_RXSCL, HDMI_FPGA_RXSDA, HDMI_FPGA_RXHPD
HDMI_FPGA_TX_I2C: HDMI_FPGA_TXSCL, HDMI_FPGA_TXSDA
REC_CLOCK: REC_CLOCK_C_P, REC_CLOCK_C_N
SFP+_Management: SFP+_0_LOS, SFP+_0_TX_DIS, SFP+_0_Link, SFP+_0_ACT, SFP+_1_LOS, SFP+_1_TX_DIS, SFP+_1_Link, SFP+_1_ACT, SFP+_2_LOS, SFP+_2_TX_DIS, SFP+_2_Link, SFP+_2_ACT, SFP+_3_LOS, SFP+_3_TX_DIS, SFP+_3_Link, SFP+_3_ACT
CRUVI_A: CRUVI_A_SMB_ALERT, CRUVI_A_SMB_SDA, CRUVI_A_SMB_SCL, CRUVI_A_REFCLK, CRUVI_A_DI, CRUVI_A_DO, CRUVI_A_SEL, CRUVI_A_MODE, CRUVI_A_SCK, CRUVI_A_HSIO, CRUVI_A_HSO, CRUVI_A_RESET, CRUVI_A_HSI, CRUVI_A_0_P, CRUVI_A_0_N, CRUVI_A_1_P, CRUVI_A_1_N, CRUVI_A_2_P, CRUVI_A_2_N, CRUVI_A_3_P, CRUVI_A_3_N, CRUVI_A_4_P, CRUVI_A_4_N, CRUVI_A_5_P, CRUVI_A_5_N, CRUVI_A_6_P, CRUVI_A_6_N, CRUVI_A_7_P, CRUVI_A_7_N, CRUVI_A_8_P, CRUVI_A_8_N, CRUVI_A_9_P, CRUVI_A_9_N, CRUVI_A_10_P, CRUVI_A_10_N, CRUVI_A_11_P, CRUVI_A_11_N
CRUVI_B: CRUVI_B_SMB_ALERT, CRUVI_B_SMB_SDA, CRUVI_B_SMB_SCL, CRUVI_B_REFCLK, CRUVI_B_DI, CRUVI_B_DO, CRUVI_B_SEL, CRUVI_B_MODE, CRUVI_B_SCK, CRUVI_B_HSIO, CRUVI_B_HSO, CRUVI_B_RESET, CRUVI_B_HSI, CRUVI_B_0_P, CRUVI_B_0_N, CRUVI_B_1_P, CRUVI_B_1_N, CRUVI_B_2_P, CRUVI_B_2_N, CRUVI_B_3_P, CRUVI_B_3_N, CRUVI_B_4_P, CRUVI_B_4_N, CRUVI_B_5_P, CRUVI_B_5_N, CRUVI_B_6_P, CRUVI_B_6_N, CRUVI_B_7_P, CRUVI_B_7_N, CRUVI_B_8_P, CRUVI_B_8_N, CRUVI_B_9_P, CRUVI_B_9_N, CRUVI_B_10_P, CRUVI_B_10_N, CRUVI_B_11_P, CRUVI_B_11_N

### Nets
GND: J16.0 J16.1 J29.1 J30.1
VCC3V3: Q7.1(G) Q8.1(G) Q12.1(G) R91.2 R93.2 R283.2 R284.2 R285.2 R286.2 R291.2
VCC5V: J16.2 R92.2
VCC12V: J29.2 J30.2
CRUVI_A_0_N: U1.F13(IO_L15N_T2_DQS_16) ; port CRUVI_A.CRUVI_A_0_N
CRUVI_A_0_P: U1.F14(IO_L15P_T2_DQS_16) ; port CRUVI_A.CRUVI_A_0_P
CRUVI_A_1_N: U1.A12(IO_L24N_T3_16) ; port CRUVI_A.CRUVI_A_1_N
CRUVI_A_1_P: U1.A13(IO_L24P_T3_16) ; port CRUVI_A.CRUVI_A_1_P
CRUVI_A_2_N: U1.D8(IO_L8N_T1_16) ; port CRUVI_A.CRUVI_A_2_N
CRUVI_A_2_P: U1.D9(IO_L8P_T1_16) ; port CRUVI_A.CRUVI_A_2_P
CRUVI_A_3_N: U1.B9(IO_L10N_T1_16) ; port CRUVI_A.CRUVI_A_3_N
CRUVI_A_3_P: U1.C9(IO_L10P_T1_16) ; port CRUVI_A.CRUVI_A_3_P
CRUVI_A_4_N: U1.A10(IO_L22N_T3_16) ; port CRUVI_A.CRUVI_A_4_N
CRUVI_A_4_P: U1.B10(IO_L22P_T3_16) ; port CRUVI_A.CRUVI_A_4_P
CRUVI_A_5_N: U1.B11(IO_L20N_T3_16) ; port CRUVI_A.CRUVI_A_5_N
CRUVI_A_5_P: U1.B12(IO_L20P_T3_16) ; port CRUVI_A.CRUVI_A_5_P
CRUVI_A_6_N: U1.C11(IO_L13N_T2_MRCC_16) ; port CRUVI_A.CRUVI_A_6_N
CRUVI_A_6_P: U1.C12(IO_L13P_T2_MRCC_16) ; port CRUVI_A.CRUVI_A_6_P
CRUVI_A_7_N: U1.A14(IO_L21N_T3_DQS_16) ; port CRUVI_A.CRUVI_A_7_N
CRUVI_A_7_P: U1.B14(IO_L21P_T3_DQS_16) ; port CRUVI_A.CRUVI_A_7_P
CRUVI_A_8_N: U1.A15(IO_L23N_T3_16) ; port CRUVI_A.CRUVI_A_8_N
CRUVI_A_8_P: U1.B15(IO_L23P_T3_16) ; port CRUVI_A.CRUVI_A_8_P
CRUVI_A_9_N: U1.C13(IO_L19N_T3_VREF_16) ; port CRUVI_A.CRUVI_A_9_N
CRUVI_A_9_P: U1.C14(IO_L19P_T3_16) ; port CRUVI_A.CRUVI_A_9_P
CRUVI_A_10_N: U1.G14(IO_L5N_T0_16) ; port CRUVI_A.CRUVI_A_10_N
CRUVI_A_10_P: U1.H14(IO_L5P_T0_16) ; port CRUVI_A.CRUVI_A_10_P
CRUVI_A_11_N: U1.D13(IO_L17N_T2_16) ; port CRUVI_A.CRUVI_A_11_N
CRUVI_A_11_P: U1.D14(IO_L17P_T2_16) ; port CRUVI_A.CRUVI_A_11_P
CRUVI_A_DI: U1.G19(IO_L16P_T2_A28_15) ; port CRUVI_A.CRUVI_A_DI
CRUVI_A_DO: U1.D20(IO_L15N_T2_DQS_ADV_B_15) ; port CRUVI_A.CRUVI_A_DO
CRUVI_A_HSI: U1.F17(IO_L12P_T1_MRCC_AD5P_15) ; port CRUVI_A.CRUVI_A_HSI
CRUVI_A_HSIO: U1.H18(IO_L14N_T2_SRCC_15) ; port CRUVI_A.CRUVI_A_HSIO
CRUVI_A_HSO: U1.H17(IO_L14P_T2_SRCC_15) ; port CRUVI_A.CRUVI_A_HSO
CRUVI_A_MODE: U1.F20(IO_L16N_T2_A27_15) ; port CRUVI_A.CRUVI_A_MODE
CRUVI_A_REFCLK: U1.E17(IO_L12N_T1_MRCC_AD5N_15) ; port CRUVI_A.CRUVI_A_REFCLK
CRUVI_A_RESET: U1.H16(IO_L7P_T1_AD10P_15) ; port CRUVI_A.CRUVI_A_RESET
CRUVI_A_SCK: U1.G20(IO_L18N_T2_A23_15) ; port CRUVI_A.CRUVI_A_SCK
CRUVI_A_SEL: U1.E20(IO_L17N_T2_A25_15) ; port CRUVI_A.CRUVI_A_SEL
CRUVI_A_SMB_ALERT: U1.H19(IO_L18P_T2_A24_15) ; port CRUVI_A.CRUVI_A_SMB_ALERT
CRUVI_A_SMB_SCL: R285.1 U1.G17(IO_L11P_T1_SRCC_AD12P_15) ; port CRUVI_A.CRUVI_A_SMB_SCL
CRUVI_A_SMB_SDA: R283.1 U1.F19(IO_L17P_T2_A26_15) ; port CRUVI_A.CRUVI_A_SMB_SDA
CRUVI_B_0_N: U1.J10(IO_L4N_T0_16) ; port CRUVI_B.CRUVI_B_0_N
CRUVI_B_0_P: U1.J11(IO_L4P_T0_16) ; port CRUVI_B.CRUVI_B_0_P
CRUVI_B_1_N: U1.H8(IO_L1N_T0_16) ; port CRUVI_B.CRUVI_B_1_N
CRUVI_B_1_P: U1.H9(IO_L1P_T0_16) ; port CRUVI_B.CRUVI_B_1_P
CRUVI_B_2_N: U1.G9(IO_L2N_T0_16) ; port CRUVI_B.CRUVI_B_2_N
CRUVI_B_2_P: U1.G10(IO_L2P_T0_16) ; port CRUVI_B.CRUVI_B_2_P
CRUVI_B_3_N: U1.F8(IO_L7N_T1_16) ; port CRUVI_B.CRUVI_B_3_N
CRUVI_B_3_P: U1.F9(IO_L7P_T1_16) ; port CRUVI_B.CRUVI_B_3_P
CRUVI_B_4_N: U1.F10(IO_L11N_T1_SRCC_16) ; port CRUVI_B.CRUVI_B_4_N
CRUVI_B_4_P: U1.G11(IO_L11P_T1_SRCC_16) ; port CRUVI_B.CRUVI_B_4_P
CRUVI_B_5_N: U1.D10(IO_L12N_T1_MRCC_16) ; port CRUVI_B.CRUVI_B_5_N
CRUVI_B_5_P: U1.E10(IO_L12P_T1_MRCC_16) ; port CRUVI_B.CRUVI_B_5_P
CRUVI_B_6_N: U1.A8(IO_L9N_T1_DQS_16) ; port CRUVI_B.CRUVI_B_6_N
CRUVI_B_6_P: U1.A9(IO_L9P_T1_DQS_16) ; port CRUVI_B.CRUVI_B_6_P
CRUVI_B_7_N: U1.D11(IO_L14N_T2_SRCC_16) ; port CRUVI_B.CRUVI_B_7_N
CRUVI_B_7_P: U1.E11(IO_L14P_T2_SRCC_16) ; port CRUVI_B.CRUVI_B_7_P
CRUVI_B_8_N: U1.F12(IO_L16N_T2_16) ; port CRUVI_B.CRUVI_B_8_N
CRUVI_B_8_P: U1.G12(IO_L16P_T2_16) ; port CRUVI_B.CRUVI_B_8_P
CRUVI_B_9_N: U1.E12(IO_L18N_T2_16) ; port CRUVI_B.CRUVI_B_9_N
CRUVI_B_9_P: U1.E13(IO_L18P_T2_16) ; port CRUVI_B.CRUVI_B_9_P
CRUVI_B_10_N: U1.H11(IO_L6N_T0_VREF_16) ; port CRUVI_B.CRUVI_B_10_N
CRUVI_B_10_P: U1.H12(IO_L6P_T0_16) ; port CRUVI_B.CRUVI_B_10_P
CRUVI_B_11_N: U1.H13(IO_L3N_T0_DQS_16) ; port CRUVI_B.CRUVI_B_11_N
CRUVI_B_11_P: U1.J13(IO_L3P_T0_DQS_16) ; port CRUVI_B.CRUVI_B_11_P
CRUVI_B_DI: U1.J15(IO_L9P_T1_DQS_AD11P_15) ; port CRUVI_B.CRUVI_B_DI
CRUVI_B_DO: U1.C18(IO_L5N_T0_AD2N_15) ; port CRUVI_B.CRUVI_B_DO
CRUVI_B_HSI: U1.G16(IO_L7N_T1_AD10N_15) ; port CRUVI_B.CRUVI_B_HSI
CRUVI_B_HSIO: U1.F15(IO_L8N_T1_AD3N_15) ; port CRUVI_B.CRUVI_B_HSIO
CRUVI_B_HSO: U1.D16(IO_L6N_T0_VREF_15) ; port CRUVI_B.CRUVI_B_HSO
CRUVI_B_MODE: U1.E18(IO_L13P_T2_MRCC_15) ; port CRUVI_B.CRUVI_B_MODE
CRUVI_B_REFCLK: U1.E16(IO_L10N_T1_AD4N_15) ; port CRUVI_B.CRUVI_B_REFCLK
CRUVI_B_RESET: U1.D15(IO_L6P_T0_15) ; port CRUVI_B.CRUVI_B_RESET
CRUVI_B_SCK: U1.D19(IO_L15P_T2_DQS_15) ; port CRUVI_B.CRUVI_B_SCK
CRUVI_B_SEL: U1.D18(IO_L13N_T2_MRCC_15) ; port CRUVI_B.CRUVI_B_SEL
CRUVI_B_SMB_ALERT: U1.G15(IO_L8P_T1_AD3P_15) ; port CRUVI_B.CRUVI_B_SMB_ALERT
CRUVI_B_SMB_SCL: R286.1 U1.E15(IO_L10P_T1_AD4P_15) ; port CRUVI_B.CRUVI_B_SMB_SCL
CRUVI_B_SMB_SDA: R284.1 U1.J16(IO_L9N_T1_DQS_AD11N_15) ; port CRUVI_B.CRUVI_B_SMB_SDA
FPGA_FAN_PWM: Q8.2(D) R93.1 U1.C17(IO_L5P_T0_AD2P_15)
FPGA_FAN_TACH: Q7.2(D) R91.1 U1.B19(IO_L4N_T0_AD9N_15)
HDMI_FPGA_RX0_N: U1.N24(IO_L4N_T0_13) ; port FPGA_HDMI_RX.HDMI_FPGA_RX0_N
HDMI_FPGA_RX0_P: U1.P24(IO_L4P_T0_13) ; port FPGA_HDMI_RX.HDMI_FPGA_RX0_P
HDMI_FPGA_RX1_N: U1.P26(IO_L2N_T0_13) ; port FPGA_HDMI_RX.HDMI_FPGA_RX1_N
HDMI_FPGA_RX1_P: U1.R26(IO_L2P_T0_13) ; port FPGA_HDMI_RX.HDMI_FPGA_RX1_P
HDMI_FPGA_RX2_N: U1.P25(IO_L6N_T0_VREF_13) ; port FPGA_HDMI_RX.HDMI_FPGA_RX2_N
HDMI_FPGA_RX2_P: U1.R25(IO_L6P_T0_13) ; port FPGA_HDMI_RX.HDMI_FPGA_RX2_P
HDMI_FPGA_RXC_N: U1.L24(IO_L8N_T1_13) ; port FPGA_HDMI_RX.HDMI_FPGA_RXC_N
HDMI_FPGA_RXC_P: U1.M24(IO_L8P_T1_13) ; port FPGA_HDMI_RX.HDMI_FPGA_RXC_P
HDMI_FPGA_RXCEC: U1.N23(IO_L11N_T1_SRCC_13) ; port FPGA_HDMI_RX.HDMI_FPGA_RXCEC
HDMI_FPGA_RXHPD: U1.M22(IO_L10N_T1_13) ; port FPGA_HDMI_RX.HDMI_FPGA_RXHPD
HDMI_FPGA_RXSCL: U1.P23(IO_L11P_T1_SRCC_13) ; port FPGA_HDMI_RX.HDMI_FPGA_RXSCL
HDMI_FPGA_RXSDA: U1.M21(IO_L10P_T1_13) ; port FPGA_HDMI_RX.HDMI_FPGA_RXSDA
HDMI_FPGA_TX0_N: U1.P20(IO_L9N_T1_DQS_13) ; port FPGA_HDMI_TX.HDMI_FPGA_TX0_N
HDMI_FPGA_TX0_P: U1.P19(IO_L9P_T1_DQS_13) ; port FPGA_HDMI_TX.HDMI_FPGA_TX0_P
HDMI_FPGA_TX1_N: U1.K26(IO_L1N_T0_13) ; port FPGA_HDMI_TX.HDMI_FPGA_TX1_N
HDMI_FPGA_TX1_P: U1.K25(IO_L1P_T0_13) ; port FPGA_HDMI_TX.HDMI_FPGA_TX1_P
HDMI_FPGA_TX2_N: U1.L25(IO_L3N_T0_DQS_13) ; port FPGA_HDMI_TX.HDMI_FPGA_TX2_N
HDMI_FPGA_TX2_P: U1.M25(IO_L3P_T0_DQS_13) ; port FPGA_HDMI_TX.HDMI_FPGA_TX2_P
HDMI_FPGA_TXC_N: U1.M20(IO_L7N_T1_13) ; port FPGA_HDMI_TX.HDMI_FPGA_TXC_N
HDMI_FPGA_TXC_P: U1.N19(IO_L7P_T1_13) ; port FPGA_HDMI_TX.HDMI_FPGA_TXC_P
HDMI_FPGA_TXCEC: U1.N26(IO_L5P_T0_13) ; port FPGA_HDMI_TX.HDMI_FPGA_TXCEC
HDMI_FPGA_TXHPD: U1.M26(IO_L5N_T0_13) ; port FPGA_HDMI_TX.HDMI_FPGA_TXHPD
HDMI_FPGA_TXSCL: port FPGA_HDMI_TX.HDMI_FPGA_TXSCL, port HDMI_FPGA_TX_I2C.HDMI_FPGA_TXSCL
HDMI_FPGA_TXSDA: port FPGA_HDMI_TX.HDMI_FPGA_TXSDA, port HDMI_FPGA_TX_I2C.HDMI_FPGA_TXSDA
PCIe_PERST: U1.B16(IO_L1N_T0_AD0N_15) ; port PCIe_PERST
PI_~{EXTRST}: U1.A18(IO_L2P_T0_AD8P_15) ; port PI_~{EXTRST}
REC_CLOCK_C_N: U1.P21(IO_L13N_T2_MRCC_13) ; port REC_CLOCK.REC_CLOCK_C_N
REC_CLOCK_C_P: U1.R21(IO_L13P_T2_MRCC_13) ; port REC_CLOCK.REC_CLOCK_C_P
SFP+_0_ACT: U1.T25(IO_L15N_T2_DQS_13) ; port SFP+_Management.SFP+_0_ACT
SFP+_0_Link: U1.T24(IO_L15P_T2_DQS_13) ; port SFP+_Management.SFP+_0_Link
SFP+_0_LOS: U1.T19(IO_L19N_T3_VREF_13) ; port SFP+_Management.SFP+_0_LOS
SFP+_0_TX_DIS: U1.R18(IO_L24P_T3_13) ; port SFP+_Management.SFP+_0_TX_DIS
SFP+_1_ACT: U1.R23(IO_L14N_T2_SRCC_13) ; port SFP+_Management.SFP+_1_ACT
SFP+_1_Link: U1.T22(IO_L17P_T2_13) ; port SFP+_Management.SFP+_1_Link
SFP+_1_LOS: U1.M19(IO_L22N_T3_13) ; port SFP+_Management.SFP+_1_LOS
SFP+_1_TX_DIS: U1.N18(IO_L22P_T3_13) ; port SFP+_Management.SFP+_1_TX_DIS
SFP+_2_ACT: U1.N21(IO_L12P_T1_MRCC_13) ; port SFP+_Management.SFP+_2_ACT
SFP+_2_Link: U1.N22(IO_L12N_T1_MRCC_13) ; port SFP+_Management.SFP+_2_Link
SFP+_2_LOS: U1.R17(IO_L21N_T3_DQS_13) ; port SFP+_Management.SFP+_2_LOS
SFP+_2_TX_DIS: U1.N17(IO_L20N_T3_13) ; port SFP+_Management.SFP+_2_TX_DIS
SFP+_3_ACT: U1.R22(IO_L14P_T2_SRCC_13) ; port SFP+_Management.SFP+_3_ACT
SFP+_3_Link: U1.R20(IO_L16N_T2_13) ; port SFP+_Management.SFP+_3_Link
SFP+_3_LOS: U1.R16(IO_L21P_T3_DQS_13) ; port SFP+_Management.SFP+_3_LOS
SFP+_3_TX_DIS: U1.P16(IO_L20P_T3_13) ; port SFP+_Management.SFP+_3_TX_DIS
SYS_FAN_PWM: Q12.2(D) R291.1 U1.C19(IO_L4P_T0_AD9P_15)
UART_USB_~{CTS}: U1.F18(IO_L11N_T1_SRCC_AD12N_15) ; port UART_USB.UART_USB_~{CTS}
UART_USB_~{RTS}: U1.B17(IO_L3P_T0_DQS_AD1P_15) ; port UART_USB.UART_USB_~{RTS}
UART_USB_RxD: U1.A17(IO_L3N_T0_DQS_AD1N_15) ; port UART_USB.UART_USB_RxD
UART_USB_TxD: U1.K15(IO_0_15) ; port UART_USB.UART_USB_TxD
NetJ16_3: J16.3 Q7.3(S) R92.1
NetJ16_4: J16.4 Q8.3(S)
NetJ29_4: J29.4 J30.4 Q12.3(S)
NetTP8_1: TP8.1(GND) U1.M17(IO_L23P_T3_FOE_B_15)
NetTP9_1: TP9.1(GND) U1.L18(IO_L23N_T3_FWE_B_15)
NetTP10_1: TP10.1(GND) U1.L17(IO_L24P_T3_RS1_15)
NetTP11_1: TP11.1(GND) U1.K18(IO_L24N_T3_RS0_15)

Not connected (* = marked no-connect by the designer): J29 3; J30 3; U1 A19(IO_L2N_T0_AD8N_15) C16(IO_L1P_T0_AD0P_15) J8(IO_0_16) J14(IO_25_16) J18(IO_L20P_T3_A20_15) J19(IO_L20N_T3_A19_15) J20(IO_L19N_T3_A21_VREF_15) K16(IO_L22P_T3_A17_15) K17(IO_L22N_T3_A16_15) K20(IO_L19P_T3_A22_15) L19(IO_L21P_T3_DQS_15) L20(IO_L21N_T3_DQS_A18_15) M16(IO_25_15) N16(IO_0_13) P18(IO_L24N_T3_13) T17(IO_L23N_T3_13) T18(IO_L19P_T3_13) T20(IO_L16P_T2_13) T23(IO_L17N_T2_13) U16(IO_25_13) U17(IO_L23P_T3_13) U19(IO_L18P_T2_13) U20(IO_L18N_T2_13)

### Notes on the sheet
- (near U1) Bank Voltage: 3.3V
- FPGA-FAN Connector 5V
- System-FAN Connectors 12V
- Title:
- ++CONFIDENTIAL++
- Date:
- Sheet:
- /
- Time:
- Engineer
- Elektronik- und Softwareentwicklung aus Nürnberg
- The  information  contained  in  these  documents  is  confidential,  privileged  and  only  for  the
  information of the intended recipient and may
  not be used, published or redistributed without
  the prior written consent from PCB Arts GmbH.
- Revision:
- Checked:
- https://pcb-arts.com/
- mail@pcb-arts.com
- (in symbol RES_0402_1.6k_1%) 0402
- (in symbol RES_0402_10k_1%) 0402
- (in symbol XC7K160T-3FFG676E_Kintex-7 FPGA, 400 User I/Os, 8 GTX, FFG676, part B) BANK 13
- (in symbol XC7K160T-3FFG676E_Kintex-7 FPGA, 400 User I/Os, 8 GTX, FFG676, part D) BANK 15
- (in symbol XC7K160T-3FFG676E_Kintex-7 FPGA, 400 User I/Os, 8 GTX, FFG676, part E) BANK 16

### Library data of the parts
J16 = 53398-0476_1.25mm Pitch, PicoBlade PCB Header, Single Row, horizontal, SMD, 4 Pin: 1.25mm Pitch, PicoBlade PCB Header, Single Row, horizontal, SMD, 4 Pin; Manufacturer 1: Molex; Manufacturer 2 Prt. Nr.: 53398-0471; Manufacturer 1 Prt. Nr.: 53398-0476; Manufacturer 2: Molex
J29 J30 = FAN Connector header 2.54mm 4Pol Pinrex 744-81-04TG20: FAN Connector header 2.54mm 4Pol; Manufacturer 1: PINREX; Manufacturer 1 Prt. Nr.: 744-81-04TG20
Q7 Q8 Q12 = RUC002N05T116_MOSFET N-Ch 1.2 VGS Spec: MOSFET N-Ch 1.2 VGS Spec; Manufacturer 1: ROHM Semiconductor; Manufacturer 1 Prt. Nr.: RUC002N05T116
R91-R93 R291 = RES_0402_10k_1%: as R102 on sheet Bank 0_Bank 14; Manufacturer 2: Yageo
R283-R286 = RES_0402_1.6k_1%: Thick Film Resistors - SMD 1.6kOhm 1%; Manufacturer 1: Vishay / Dale; Manufacturer 1 Prt. Nr.: CRCW04021K60FKEDC; Manufacturer 2 Prt. Nr.: RC0402FR-7W1K6L; Manufacturer 2: Yageo
TP8-TP11 = Testpoint 0.8mm
U1 = XC7K160T-3FFG676E_Kintex-7 FPGA, 400 User I/Os, 8 GTX, FFG676: as U1 on sheet Bank 0_Bank 14; Manufacturer 1 Prt. Nr.: XC7K160T-3FFG676E; ComponentLink1URL: http://www.xilinx.com/support/documentation/data_sheets/ds180_7Series_Overview.pdf; ComponentLink2URL: http://www.xilinx.com/support/documentation/user_guides/ug865-Zynq-7000-Pkg-Pinout.pdf; ComponentLink1Description: Datasheet; ComponentLink2Description: Package Specification

## Sheet DDR3 Memory_Banks 32-33-34.SchDoc
size A3; SheetNumber: 2; SheetTotal: 22
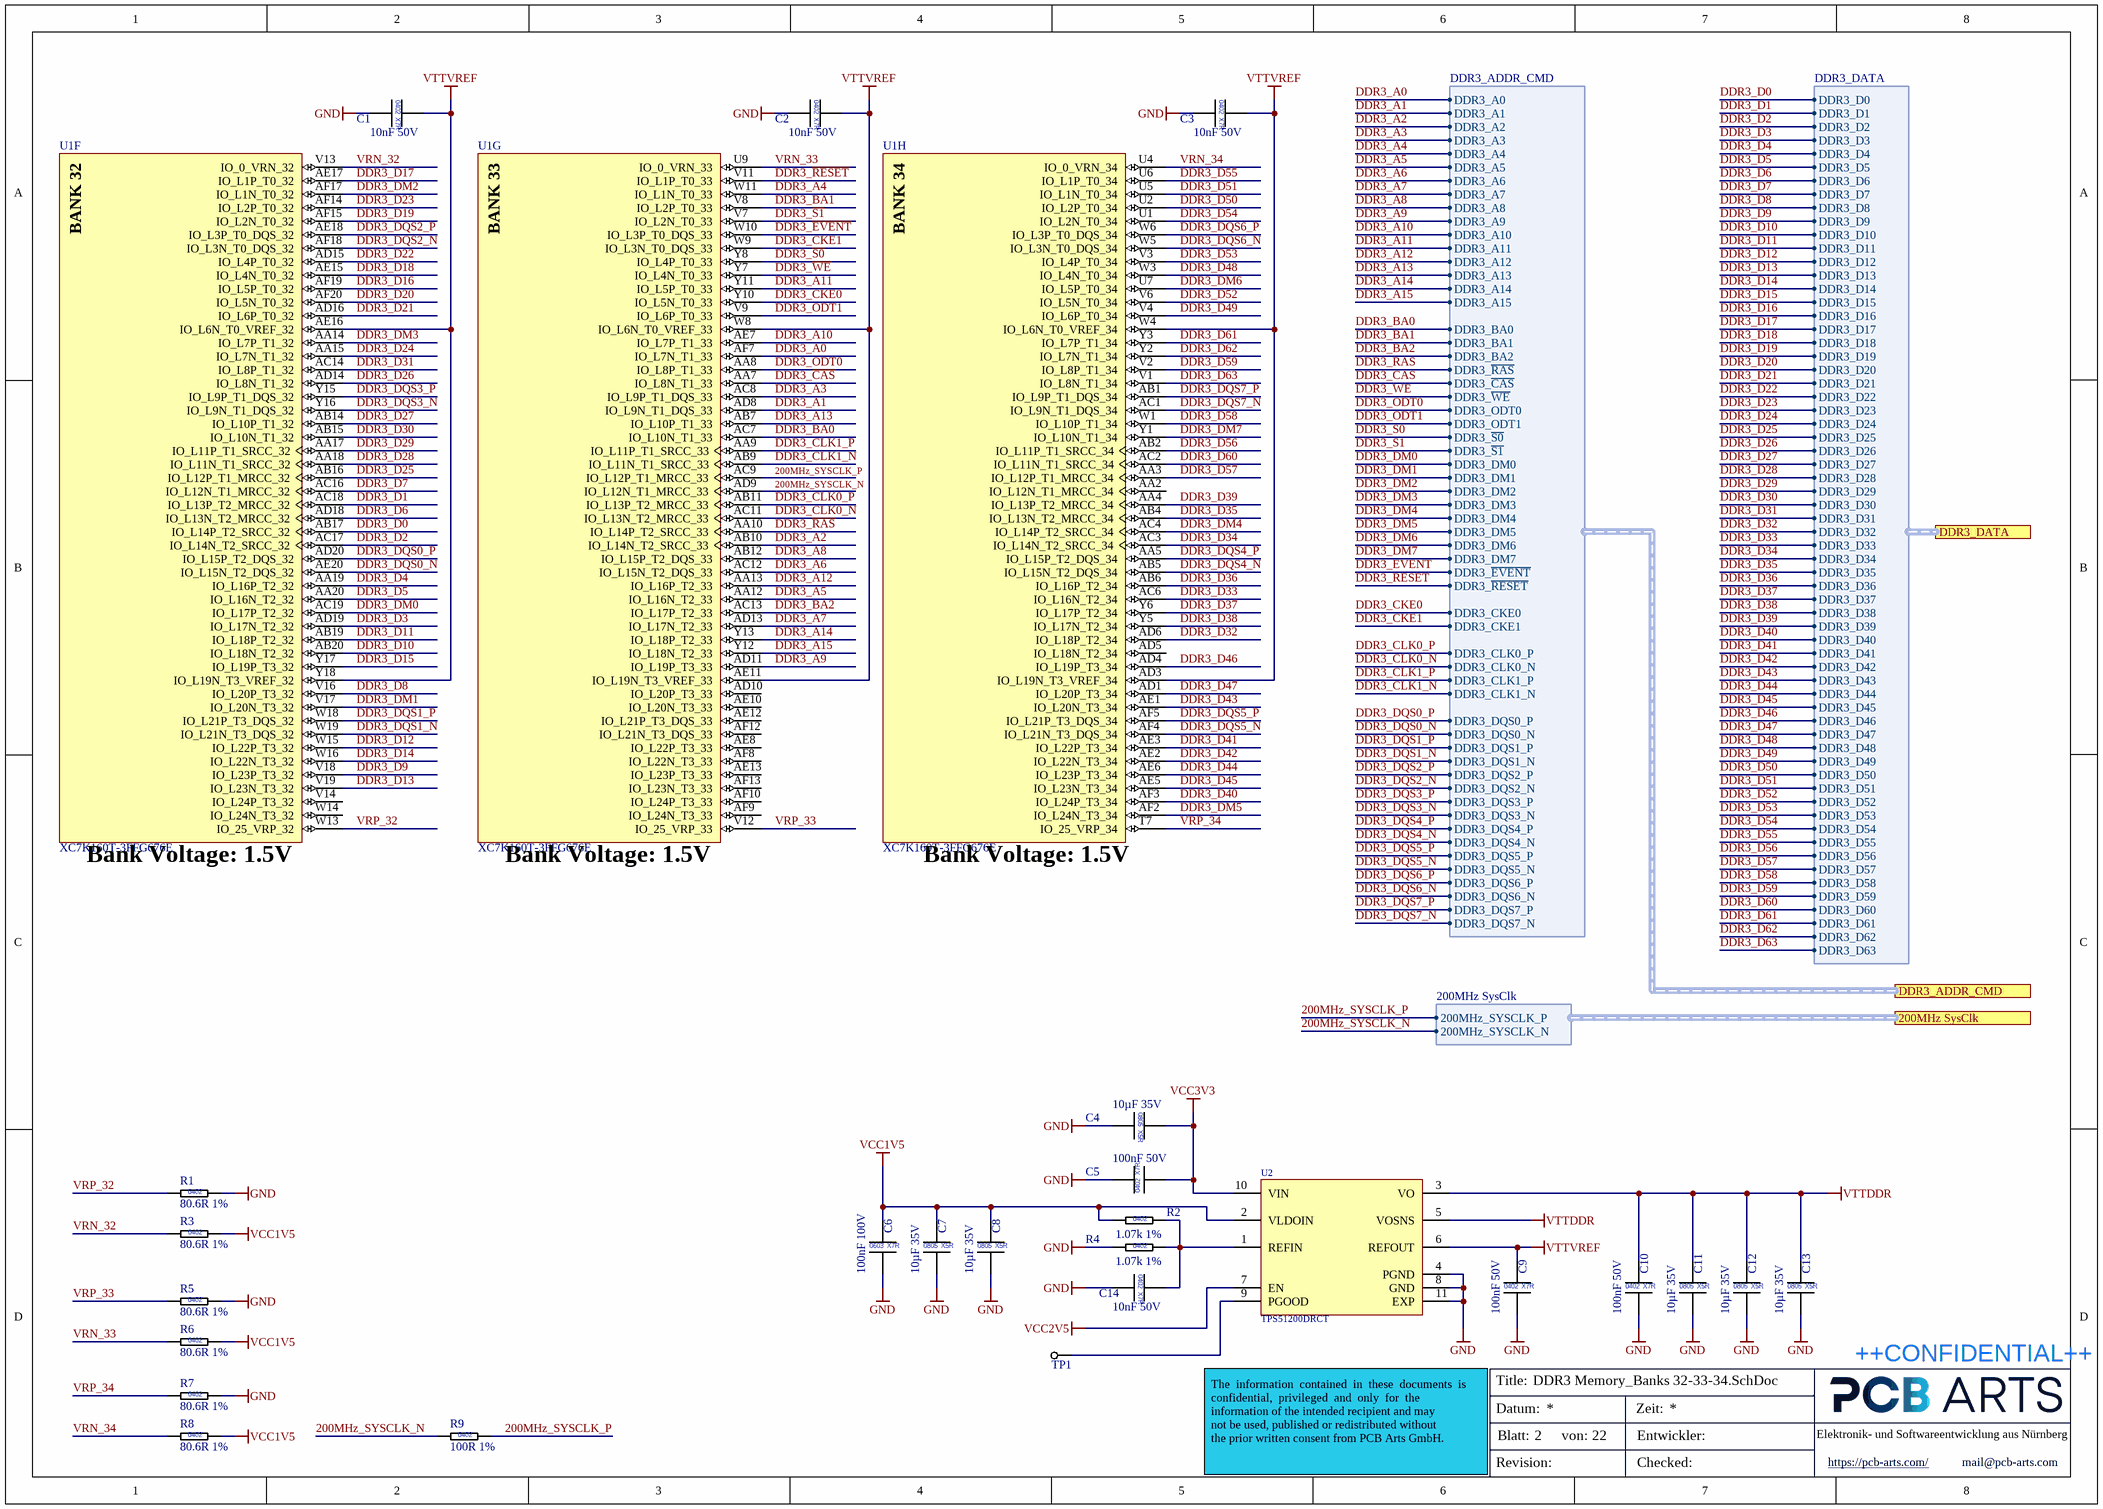
[diagram p3: DDR3 Memory_Banks 32-33-34.SchDoc]

### Parts
C1  10nF 50V  [CAP_0402_L]
C2  10nF 50V  [CAP_0402_L]
C3  10nF 50V  [CAP_0402_L]
C4  10µF 35V  [CAP_0805]
C5  100nF 50V  [CAP_0402_L]
C6  100nF 100V  [CAP_0603_L]
C7  10µF 35V  [CAP_0805]
C8  10µF 35V  [CAP_0805]
C9  100nF 50V  [CAP_0402_L]
C10  100nF 50V  [CAP_0402_L]
C11  10µF 35V  [CAP_0805]
C12  10µF 35V  [CAP_0805]
C13  10µF 35V  [CAP_0805]
C14  10nF 50V  [CAP_0402_L]
R1  80.6R 1%  [RES_0402_L]
R2  1.07k 1%  [RES_0402_L]
R3  80.6R 1%  [RES_0402_L]
R4  1.07k 1%  [RES_0402_L]
R5  80.6R 1%  [RES_0402_L]
R6  80.6R 1%  [RES_0402_L]
R7  80.6R 1%  [RES_0402_L]
R8  80.6R 1%  [RES_0402_L]
R9  100R 1%  [RES_0402_L]
TP1  Testpoint  [Testpoint 0.8mm]  (value not drawn)  (no BOM)
U1  XC7K160T-3FFG676E  [BGA100P2700X2700X317-676N]  (parts F,G,H of 14)
U2  TPS51200DRCT  [QFN50P300X300X100-11N]

### Ports
200MHz SysClk (harness 200MHz SysClk, see Top-Level-Sheet[5B], System Clocks[8A]), DDR3_ADDR_CMD (harness DDR3_ADDR_CMD, see Top-Level-Sheet[5B], DDR3 Memory_SO-DIMM[8C]), DDR3_DATA (harness DDR3_DATA, see Top-Level-Sheet[5B], DDR3 Memory_SO-DIMM[8B])

### Harnesses
DDR3_DATA: DDR3_D0, DDR3_D1, DDR3_D2, DDR3_D3, DDR3_D4, DDR3_D5, DDR3_D6, DDR3_D7, DDR3_D8, DDR3_D9, DDR3_D10, DDR3_D11, DDR3_D12, DDR3_D13, DDR3_D14, DDR3_D15, DDR3_D16, DDR3_D17, DDR3_D18, DDR3_D19, DDR3_D20, DDR3_D21, DDR3_D22, DDR3_D23, DDR3_D24, DDR3_D25, DDR3_D26, DDR3_D27, DDR3_D28, DDR3_D29, DDR3_D30, DDR3_D31, DDR3_D32, DDR3_D33, DDR3_D34, DDR3_D35, DDR3_D36, DDR3_D37, DDR3_D38, DDR3_D39, DDR3_D40, DDR3_D41, DDR3_D42, DDR3_D43, DDR3_D44, DDR3_D45, DDR3_D46, DDR3_D47, DDR3_D48, DDR3_D49, DDR3_D50, DDR3_D51, DDR3_D52, DDR3_D53, DDR3_D54, DDR3_D55, DDR3_D56, DDR3_D57, DDR3_D58, DDR3_D59, DDR3_D60, DDR3_D61, DDR3_D62, DDR3_D63
DDR3_ADDR_CMD: DDR3_A0, DDR3_BA0, DDR3_BA1, DDR3_BA2, DDR3_~{RAS}, DDR3_~{CAS}, DDR3_~{WE}, DDR3_ODT0, DDR3_ODT1, DDR3_~{S0}, DDR3_~{S1}, DDR3_DM0, DDR3_~{EVENT}, DDR3_~{RESET}, DDR3_CKE0, DDR3_CKE1, DDR3_CLK0_P, DDR3_CLK0_N, DDR3_CLK1_P, DDR3_CLK1_N, DDR3_DQS0_P, DDR3_DQS0_N, DDR3_DQS1_P, DDR3_DQS1_N, DDR3_DQS2_P, DDR3_DQS2_N, DDR3_DQS3_P, DDR3_DQS3_N, DDR3_DQS4_P, DDR3_DQS4_N, DDR3_DQS5_P, DDR3_DQS5_N, DDR3_DQS6_P, DDR3_DQS6_N, DDR3_DQS7_P, DDR3_DQS7_N, DDR3_A1, DDR3_A2, DDR3_A3, DDR3_A4, DDR3_A5, DDR3_A6, DDR3_A7, DDR3_A8, DDR3_A9, DDR3_A10, DDR3_A11, DDR3_A12, DDR3_A13, DDR3_A14, DDR3_A15, DDR3_DM1, DDR3_DM2, DDR3_DM3, DDR3_DM4, DDR3_DM5, DDR3_DM6, DDR3_DM7
200MHz SysClk: 200MHz_SYSCLK_P, 200MHz_SYSCLK_N

### Nets
GND: C1.2 C2.2 C3.2 C4.2 C5.1 C6.2 C7.2 C8.2 C9.2 C10.2 C11.2 C12.2 C13.2 C14.2 R1.2 R4.1 R5.2 R7.2 U2.4(PGND) U2.8(GND) U2.11(EXP)
VCC1V5: C6.1 C7.1 C8.1 R2.1 R3.2 R6.2 R8.2 U2.2(VLDOIN)
VCC2V5: U2.7(EN)
VCC3V3: C4.1 C5.2 U2.10(VIN)
VTTDDR: C10.1 C11.1 C12.1 C13.1 U2.3(VO) U2.5(VOSNS)
VTTVREF: C1.1 C2.1 C3.1 C9.1 U1.AD3(IO_L19N_T3_VREF_34) U1.AE11(IO_L19N_T3_VREF_33) U1.AE16(IO_L6N_T0_VREF_32) U1.W4(IO_L6N_T0_VREF_34) U1.W8(IO_L6N_T0_VREF_33) U1.Y18(IO_L19N_T3_VREF_32) U2.6(REFOUT)
200MHz_SYSCLK_N: R9.1 U1.AD9(IO_L12N_T1_MRCC_33) ; port 200MHz SysClk.200MHz_SYSCLK_N
200MHz_SYSCLK_P: R9.2 U1.AC9(IO_L12P_T1_MRCC_33) ; port 200MHz SysClk.200MHz_SYSCLK_P
DDR3_A0: U1.AF7(IO_L7N_T1_33) ; port DDR3_ADDR_CMD.DDR3_A0
DDR3_A1: U1.AD8(IO_L9N_T1_DQS_33) ; port DDR3_ADDR_CMD.DDR3_A1
DDR3_A2: U1.AB10(IO_L14N_T2_SRCC_33) ; port DDR3_ADDR_CMD.DDR3_A2
DDR3_A3: U1.AC8(IO_L9P_T1_DQS_33) ; port DDR3_ADDR_CMD.DDR3_A3
DDR3_A4: U1.W11(IO_L1N_T0_33) ; port DDR3_ADDR_CMD.DDR3_A4
DDR3_A5: U1.AA12(IO_L16N_T2_33) ; port DDR3_ADDR_CMD.DDR3_A5
DDR3_A6: U1.AC12(IO_L15N_T2_DQS_33) ; port DDR3_ADDR_CMD.DDR3_A6
DDR3_A7: U1.AD13(IO_L17N_T2_33) ; port DDR3_ADDR_CMD.DDR3_A7
DDR3_A8: U1.AB12(IO_L15P_T2_DQS_33) ; port DDR3_ADDR_CMD.DDR3_A8
DDR3_A9: U1.AD11(IO_L19P_T3_33) ; port DDR3_ADDR_CMD.DDR3_A9
DDR3_A10: U1.AE7(IO_L7P_T1_33) ; port DDR3_ADDR_CMD.DDR3_A10
DDR3_A11: U1.Y11(IO_L5P_T0_33) ; port DDR3_ADDR_CMD.DDR3_A11
DDR3_A12: U1.AA13(IO_L16P_T2_33) ; port DDR3_ADDR_CMD.DDR3_A12
DDR3_A13: U1.AB7(IO_L10P_T1_33) ; port DDR3_ADDR_CMD.DDR3_A13
DDR3_A14: U1.Y13(IO_L18P_T2_33) ; port DDR3_ADDR_CMD.DDR3_A14
DDR3_A15: U1.Y12(IO_L18N_T2_33) ; port DDR3_ADDR_CMD.DDR3_A15
DDR3_BA0: U1.AC7(IO_L10N_T1_33) ; port DDR3_ADDR_CMD.DDR3_BA0
DDR3_BA1: U1.V8(IO_L2P_T0_33) ; port DDR3_ADDR_CMD.DDR3_BA1
DDR3_BA2: U1.AC13(IO_L17P_T2_33) ; port DDR3_ADDR_CMD.DDR3_BA2
DDR3_~{CAS}: U1.AA7(IO_L8N_T1_33) ; port DDR3_ADDR_CMD.DDR3_~{CAS}
DDR3_CKE0: U1.Y10(IO_L5N_T0_33) ; port DDR3_ADDR_CMD.DDR3_CKE0
DDR3_CKE1: U1.W9(IO_L3N_T0_DQS_33) ; port DDR3_ADDR_CMD.DDR3_CKE1
DDR3_CLK0_N: U1.AC11(IO_L13N_T2_MRCC_33) ; port DDR3_ADDR_CMD.DDR3_CLK0_N
DDR3_CLK0_P: U1.AB11(IO_L13P_T2_MRCC_33) ; port DDR3_ADDR_CMD.DDR3_CLK0_P
DDR3_CLK1_N: U1.AB9(IO_L11N_T1_SRCC_33) ; port DDR3_ADDR_CMD.DDR3_CLK1_N
DDR3_CLK1_P: U1.AA9(IO_L11P_T1_SRCC_33) ; port DDR3_ADDR_CMD.DDR3_CLK1_P
DDR3_D0: U1.AB17(IO_L14P_T2_SRCC_32) ; port DDR3_DATA.DDR3_D0
DDR3_D1: U1.AC18(IO_L13P_T2_MRCC_32) ; port DDR3_DATA.DDR3_D1
DDR3_D2: U1.AC17(IO_L14N_T2_SRCC_32) ; port DDR3_DATA.DDR3_D2
DDR3_D3: U1.AD19(IO_L17N_T2_32) ; port DDR3_DATA.DDR3_D3
DDR3_D4: U1.AA19(IO_L16P_T2_32) ; port DDR3_DATA.DDR3_D4
DDR3_D5: U1.AA20(IO_L16N_T2_32) ; port DDR3_DATA.DDR3_D5
DDR3_D6: U1.AD18(IO_L13N_T2_MRCC_32) ; port DDR3_DATA.DDR3_D6
DDR3_D7: U1.AC16(IO_L12N_T1_MRCC_32) ; port DDR3_DATA.DDR3_D7
DDR3_D8: U1.V16(IO_L20P_T3_32) ; port DDR3_DATA.DDR3_D8
DDR3_D9: U1.V18(IO_L23P_T3_32) ; port DDR3_DATA.DDR3_D9
DDR3_D10: U1.AB20(IO_L18N_T2_32) ; port DDR3_DATA.DDR3_D10
DDR3_D11: U1.AB19(IO_L18P_T2_32) ; port DDR3_DATA.DDR3_D11
DDR3_D12: U1.W15(IO_L22P_T3_32) ; port DDR3_DATA.DDR3_D12
DDR3_D13: U1.V19(IO_L23N_T3_32) ; port DDR3_DATA.DDR3_D13
DDR3_D14: U1.W16(IO_L22N_T3_32) ; port DDR3_DATA.DDR3_D14
DDR3_D15: U1.Y17(IO_L19P_T3_32) ; port DDR3_DATA.DDR3_D15
DDR3_D16: U1.AF19(IO_L5P_T0_32) ; port DDR3_DATA.DDR3_D16
DDR3_D17: U1.AE17(IO_L1P_T0_32) ; port DDR3_DATA.DDR3_D17
DDR3_D18: U1.AE15(IO_L4N_T0_32) ; port DDR3_DATA.DDR3_D18
DDR3_D19: U1.AF15(IO_L2N_T0_32) ; port DDR3_DATA.DDR3_D19
DDR3_D20: U1.AF20(IO_L5N_T0_32) ; port DDR3_DATA.DDR3_D20
DDR3_D21: U1.AD16(IO_L6P_T0_32) ; port DDR3_DATA.DDR3_D21
DDR3_D22: U1.AD15(IO_L4P_T0_32) ; port DDR3_DATA.DDR3_D22
DDR3_D23: U1.AF14(IO_L2P_T0_32) ; port DDR3_DATA.DDR3_D23
DDR3_D24: U1.AA15(IO_L7N_T1_32) ; port DDR3_DATA.DDR3_D24
DDR3_D25: U1.AB16(IO_L12P_T1_MRCC_32) ; port DDR3_DATA.DDR3_D25
DDR3_D26: U1.AD14(IO_L8N_T1_32) ; port DDR3_DATA.DDR3_D26
DDR3_D27: U1.AB14(IO_L10P_T1_32) ; port DDR3_DATA.DDR3_D27
DDR3_D28: U1.AA18(IO_L11N_T1_SRCC_32) ; port DDR3_DATA.DDR3_D28
DDR3_D29: U1.AA17(IO_L11P_T1_SRCC_32) ; port DDR3_DATA.DDR3_D29
DDR3_D30: U1.AB15(IO_L10N_T1_32) ; port DDR3_DATA.DDR3_D30
DDR3_D31: U1.AC14(IO_L8P_T1_32) ; port DDR3_DATA.DDR3_D31
DDR3_D32: U1.AD6(IO_L18P_T2_34) ; port DDR3_DATA.DDR3_D32
DDR3_D33: U1.AC6(IO_L16N_T2_34) ; port DDR3_DATA.DDR3_D33
DDR3_D34: U1.AC3(IO_L14N_T2_SRCC_34) ; port DDR3_DATA.DDR3_D34
DDR3_D35: U1.AB4(IO_L13N_T2_MRCC_34) ; port DDR3_DATA.DDR3_D35
DDR3_D36: U1.AB6(IO_L16P_T2_34) ; port DDR3_DATA.DDR3_D36
DDR3_D37: U1.Y6(IO_L17P_T2_34) ; port DDR3_DATA.DDR3_D37
DDR3_D38: U1.Y5(IO_L17N_T2_34) ; port DDR3_DATA.DDR3_D38
DDR3_D39: U1.AA4(IO_L13P_T2_MRCC_34) ; port DDR3_DATA.DDR3_D39
DDR3_D40: U1.AF3(IO_L24P_T3_34) ; port DDR3_DATA.DDR3_D40
DDR3_D41: U1.AE3(IO_L22P_T3_34) ; port DDR3_DATA.DDR3_D41
DDR3_D42: U1.AE2(IO_L22N_T3_34) ; port DDR3_DATA.DDR3_D42
DDR3_D43: U1.AE1(IO_L20N_T3_34) ; port DDR3_DATA.DDR3_D43
DDR3_D44: U1.AE6(IO_L23P_T3_34) ; port DDR3_DATA.DDR3_D44
DDR3_D45: U1.AE5(IO_L23N_T3_34) ; port DDR3_DATA.DDR3_D45
DDR3_D46: U1.AD4(IO_L19P_T3_34) ; port DDR3_DATA.DDR3_D46
DDR3_D47: U1.AD1(IO_L20P_T3_34) ; port DDR3_DATA.DDR3_D47
DDR3_D48: U1.W3(IO_L4N_T0_34) ; port DDR3_DATA.DDR3_D48
DDR3_D49: U1.V4(IO_L6P_T0_34) ; port DDR3_DATA.DDR3_D49
DDR3_D50: U1.U2(IO_L2P_T0_34) ; port DDR3_DATA.DDR3_D50
DDR3_D51: U1.U5(IO_L1N_T0_34) ; port DDR3_DATA.DDR3_D51
DDR3_D52: U1.V6(IO_L5N_T0_34) ; port DDR3_DATA.DDR3_D52
DDR3_D53: U1.V3(IO_L4P_T0_34) ; port DDR3_DATA.DDR3_D53
DDR3_D54: U1.U1(IO_L2N_T0_34) ; port DDR3_DATA.DDR3_D54
DDR3_D55: U1.U6(IO_L1P_T0_34) ; port DDR3_DATA.DDR3_D55
DDR3_D56: U1.AB2(IO_L11P_T1_SRCC_34) ; port DDR3_DATA.DDR3_D56
DDR3_D57: U1.AA3(IO_L12P_T1_MRCC_34) ; port DDR3_DATA.DDR3_D57
DDR3_D58: U1.W1(IO_L10P_T1_34) ; port DDR3_DATA.DDR3_D58
DDR3_D59: U1.V2(IO_L8P_T1_34) ; port DDR3_DATA.DDR3_D59
DDR3_D60: U1.AC2(IO_L11N_T1_SRCC_34) ; port DDR3_DATA.DDR3_D60
DDR3_D61: U1.Y3(IO_L7P_T1_34) ; port DDR3_DATA.DDR3_D61
DDR3_D62: U1.Y2(IO_L7N_T1_34) ; port DDR3_DATA.DDR3_D62
DDR3_D63: U1.V1(IO_L8N_T1_34) ; port DDR3_DATA.DDR3_D63
DDR3_DM0: U1.AC19(IO_L17P_T2_32) ; port DDR3_ADDR_CMD.DDR3_DM0
DDR3_DM1: U1.V17(IO_L20N_T3_32) ; port DDR3_ADDR_CMD.DDR3_DM1
DDR3_DM2: U1.AF17(IO_L1N_T0_32) ; port DDR3_ADDR_CMD.DDR3_DM2
DDR3_DM3: U1.AA14(IO_L7P_T1_32) ; port DDR3_ADDR_CMD.DDR3_DM3
DDR3_DM4: U1.AC4(IO_L14P_T2_SRCC_34) ; port DDR3_ADDR_CMD.DDR3_DM4
DDR3_DM5: U1.AF2(IO_L24N_T3_34) ; port DDR3_ADDR_CMD.DDR3_DM5
DDR3_DM6: U1.U7(IO_L5P_T0_34) ; port DDR3_ADDR_CMD.DDR3_DM6
DDR3_DM7: U1.Y1(IO_L10N_T1_34) ; port DDR3_ADDR_CMD.DDR3_DM7
DDR3_DQS0_N: U1.AE20(IO_L15N_T2_DQS_32) ; port DDR3_ADDR_CMD.DDR3_DQS0_N
DDR3_DQS0_P: U1.AD20(IO_L15P_T2_DQS_32) ; port DDR3_ADDR_CMD.DDR3_DQS0_P
DDR3_DQS1_N: U1.W19(IO_L21N_T3_DQS_32) ; port DDR3_ADDR_CMD.DDR3_DQS1_N
DDR3_DQS1_P: U1.W18(IO_L21P_T3_DQS_32) ; port DDR3_ADDR_CMD.DDR3_DQS1_P
DDR3_DQS2_N: U1.AF18(IO_L3N_T0_DQS_32) ; port DDR3_ADDR_CMD.DDR3_DQS2_N
DDR3_DQS2_P: U1.AE18(IO_L3P_T0_DQS_32) ; port DDR3_ADDR_CMD.DDR3_DQS2_P
DDR3_DQS3_N: U1.Y16(IO_L9N_T1_DQS_32) ; port DDR3_ADDR_CMD.DDR3_DQS3_N
DDR3_DQS3_P: U1.Y15(IO_L9P_T1_DQS_32) ; port DDR3_ADDR_CMD.DDR3_DQS3_P
DDR3_DQS4_N: U1.AB5(IO_L15N_T2_DQS_34) ; port DDR3_ADDR_CMD.DDR3_DQS4_N
DDR3_DQS4_P: U1.AA5(IO_L15P_T2_DQS_34) ; port DDR3_ADDR_CMD.DDR3_DQS4_P
DDR3_DQS5_N: U1.AF4(IO_L21N_T3_DQS_34) ; port DDR3_ADDR_CMD.DDR3_DQS5_N
DDR3_DQS5_P: U1.AF5(IO_L21P_T3_DQS_34) ; port DDR3_ADDR_CMD.DDR3_DQS5_P
DDR3_DQS6_N: U1.W5(IO_L3N_T0_DQS_34) ; port DDR3_ADDR_CMD.DDR3_DQS6_N
DDR3_DQS6_P: U1.W6(IO_L3P_T0_DQS_34) ; port DDR3_ADDR_CMD.DDR3_DQS6_P
DDR3_DQS7_N: U1.AC1(IO_L9N_T1_DQS_34) ; port DDR3_ADDR_CMD.DDR3_DQS7_N
DDR3_DQS7_P: U1.AB1(IO_L9P_T1_DQS_34) ; port DDR3_ADDR_CMD.DDR3_DQS7_P
DDR3_~{EVENT}: U1.W10(IO_L3P_T0_DQS_33) ; port DDR3_ADDR_CMD.DDR3_~{EVENT}
DDR3_ODT0: U1.AA8(IO_L8P_T1_33) ; port DDR3_ADDR_CMD.DDR3_ODT0
DDR3_ODT1: U1.V9(IO_L6P_T0_33) ; port DDR3_ADDR_CMD.DDR3_ODT1
DDR3_~{RAS}: U1.AA10(IO_L14P_T2_SRCC_33) ; port DDR3_ADDR_CMD.DDR3_~{RAS}
DDR3_~{RESET}: U1.V11(IO_L1P_T0_33) ; port DDR3_ADDR_CMD.DDR3_~{RESET}
DDR3_~{S0}: U1.Y8(IO_L4P_T0_33) ; port DDR3_ADDR_CMD.DDR3_~{S0}
DDR3_~{S1}: U1.V7(IO_L2N_T0_33) ; port DDR3_ADDR_CMD.DDR3_~{S1}
DDR3_~{WE}: U1.Y7(IO_L4N_T0_33) ; port DDR3_ADDR_CMD.DDR3_~{WE}
VRN_32: R3.1 U1.V13(IO_0_VRN_32)
VRN_33: R6.1 U1.U9(IO_0_VRN_33)
VRN_34: R8.1 U1.U4(IO_0_VRN_34)
VRP_32: R1.1 U1.W13(IO_25_VRP_32)
VRP_33: R5.1 U1.V12(IO_25_VRP_33)
VRP_34: R7.1 U1.T7(IO_25_VRP_34)
NetC14_1: C14.1 R2.2 R4.2 U2.1(REFIN)
NetTP1_1: TP1.1(GND) U2.9(PGOOD)

Not connected (* = marked no-connect by the designer): U1 AA2(IO_L12N_T1_MRCC_34) AD5(IO_L18N_T2_34) AD10(IO_L20P_T3_33) AE8(IO_L22P_T3_33) AE10(IO_L20N_T3_33) AE12(IO_L21P_T3_DQS_33) AE13(IO_L23P_T3_33) AF8(IO_L22N_T3_33) AF9(IO_L24N_T3_33) AF10(IO_L24P_T3_33) AF12(IO_L21N_T3_DQS_33) AF13(IO_L23N_T3_33) V14(IO_L24P_T3_32) W14(IO_L24N_T3_32)

### Notes on the sheet
- (near U1) Bank Voltage: 1.5V
- Title:
- ++CONFIDENTIAL++
- Datum:
- Blatt:
- von:
- Zeit:
- Entwickler:
- Elektronik- und Softwareentwicklung aus Nürnberg
- The  information  contained  in  these  documents  is  confidential,  privileged  and  only  for  the
  information of the intended recipient and may
  not be used, published or redistributed without
  the prior written consent from PCB Arts GmbH.
- Revision:
- Checked:
- https://pcb-arts.com/
- mail@pcb-arts.com
- (in symbol CAP_0402_10nF_50V) 0402; X7R
- (in symbol CAP_0402_100nF_50V) 0402; X7R
- (in symbol CAP_0603_100nF_100V) 0603; X7R
- (in symbol CAP_0805_10µF_35V) 0805; X5R
- (in symbol RES_0402_1.07k_1%) 0402
- (in symbol RES_0402_80.6R_1%) 0402
- (in symbol RES_0402_100R_1%) 0402
- (in symbol XC7K160T-3FFG676E_Kintex-7 FPGA, 400 User I/Os, 8 GTX, FFG676, part F) BANK 32
- (in symbol XC7K160T-3FFG676E_Kintex-7 FPGA, 400 User I/Os, 8 GTX, FFG676, part G) BANK 33
- (in symbol XC7K160T-3FFG676E_Kintex-7 FPGA, 400 User I/Os, 8 GTX, FFG676, part H) BANK 34

### Library data of the parts
C1-C3 C14 = CAP_0402_10nF_50V: Multilayer Ceramic Capacitors MLCC - SMD/SMT 0402 50VDC; Manufacturer 1: Wurth Elektronik; Manufacturer 1 Prt. Nr.: 885012205067; Manufacturer 2 Prt. Nr.: AC0402KPX7R9BB103; Manufacturer 2: Yageo
C4 C7 C8 C11-C13 = CAP_0805_10µF_35V: Multilayer Ceramic Capacitors MLCC - SMD/SMT 0805 35VDC; Manufacturer 1: Murata Electronics; Manufacturer 1 Prt. Nr.: GRM21BR6YA106ME43L; Manufacturer 2 Prt. Nr.: C2012X5R1V106M085AC; Manufacturer 2: TDK
C5 C9 C10 = CAP_0402_100nF_50V: as C147 on sheet Bank 0_Bank 14; Manufacturer 2: TDK
C6 = CAP_0603_100nF_100V: Multilayer Ceramic Capacitors MLCC - SMD/SMT 0603 100VDC; Manufacturer 1: Samsung Electro-Mechanics; Manufacturer 1 Prt. Nr.: CL10B104KC8NNNC; Manufacturer 2 Prt. Nr.: 06031C104KAT2A; Manufacturer 2: AVX
R1 R3 R5-R8 = RES_0402_80.6R_1%: Thick Film Resistors - SMD 80.6R 1%; Manufacturer 1: Vishay / Dale; Manufacturer 1 Prt. Nr.: CRCW040280R6FKEDC; Manufacturer 2 Prt. Nr.: RC0402FR-7W80R6L; Manufacturer 2: Yageo
R2 R4 = RES_0402_1.07k_1%: Thick Film Resistors - SMD 1.07kOhm 1%; Manufacturer 1: Vishay / Dale; Manufacturer 1 Prt. Nr.: CRCW04021K07FKEDC; Manufacturer 2 Prt. Nr.: AC0402FR-071K07L; Manufacturer 2: Yageo
R9 = RES_0402_100R_1%: as R109 on sheet Bank 0_Bank 14; Manufacturer 2: Yageo
TP1 = Testpoint 0.8mm
U1 = XC7K160T-3FFG676E_Kintex-7 FPGA, 400 User I/Os, 8 GTX, FFG676: as U1 on sheet Bank 0_Bank 14; Manufacturer 1 Prt. Nr.: XC7K160T-3FFG676E; ComponentLink1URL: http://www.xilinx.com/support/documentation/data_sheets/ds180_7Series_Overview.pdf; ComponentLink2URL: http://www.xilinx.com/support/documentation/user_guides/ug865-Zynq-7000-Pkg-Pinout.pdf; ComponentLink1Description: Datasheet; ComponentLink2Description: Package Specification
U2 = TPS51200DRCT_Sink and Source DDR Termination Regulator: Sink and Source DDR Termination Regulator; Manufacturer 1: Texas Instruments; Manufacturer 1 Prt. Nr.: TPS51200DRCT